# EAGLE schematic Pinscape Pico - Pro (SMD) Expansion Board (EAGLE 7.7.0), part 1 of 2

## Sheet 1 of 12: Main
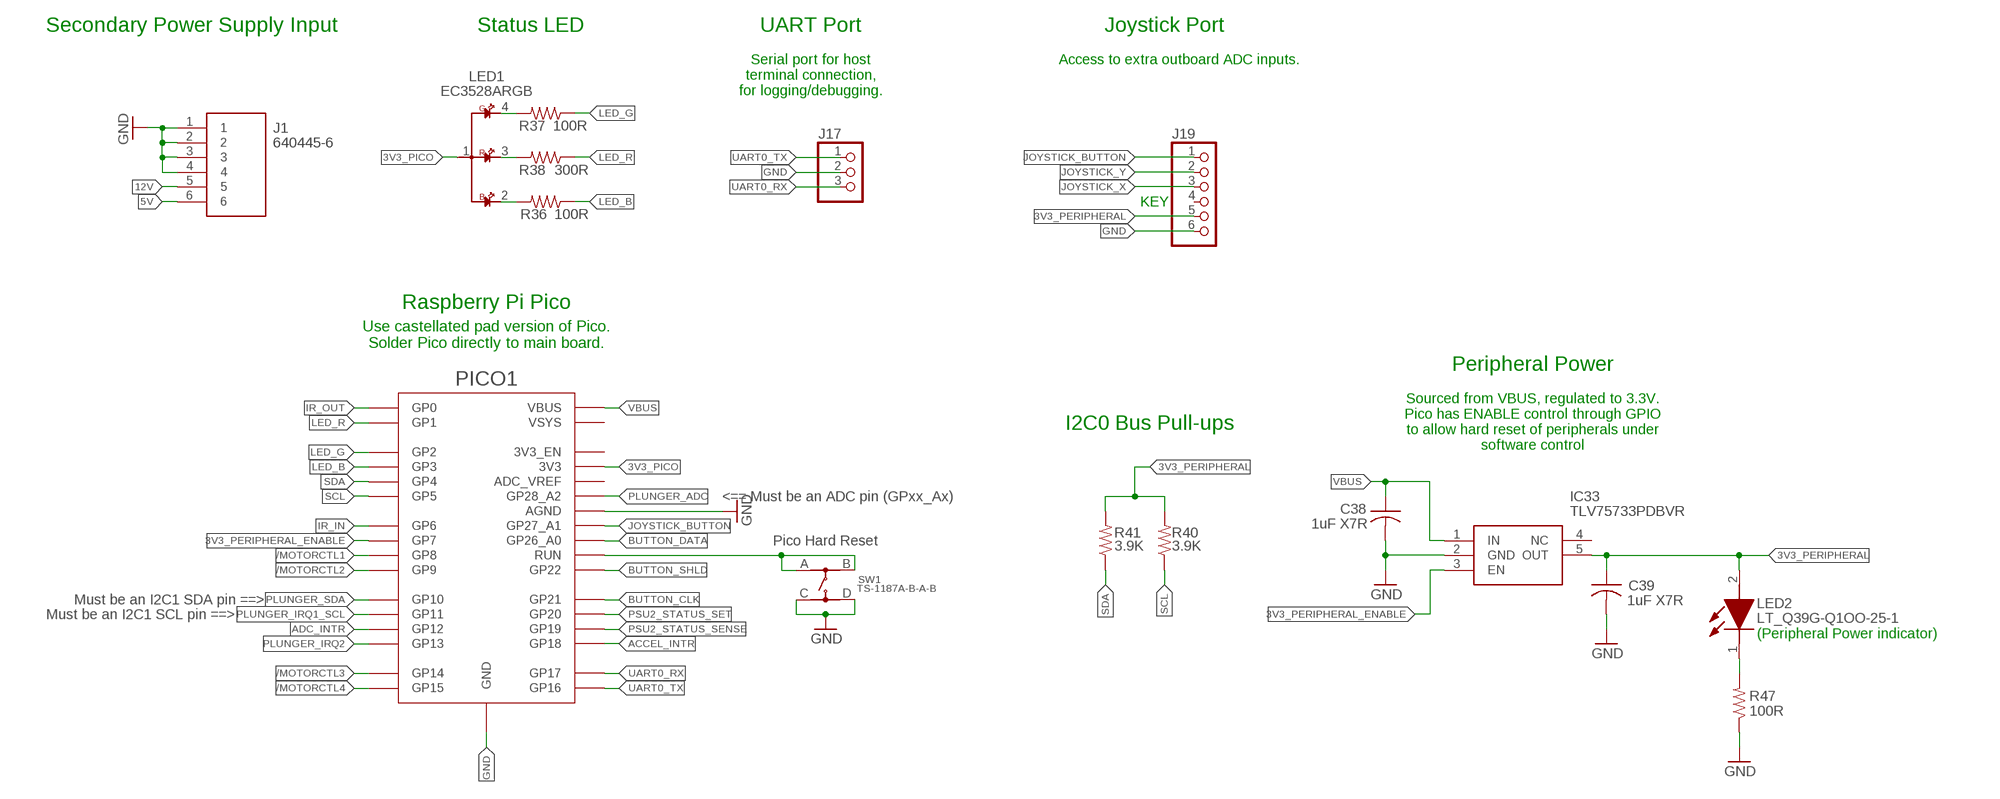
[diagram p0: schematic, sheet 1]

### Parts
C38  1uF X7R  C-USC1206  [C1206]
C39  1uF X7R  C-USC1206  [C1206]
IC33  TLV75733PDBVR  [SOT95P280X145-5N]
J1  640445-6  [SHDR6W183P0X396_1X6_2377X762X1]
J17  PINHD-1X3  [1X03]
J19  PINHD-1X6  [1X06]
LED1  EC3528ARGB  [EC3528ARGB]
LED2  LT_Q39G-Q1OO-25-1  [LEDC1608X40N]
PICO1  PICO  RPI_PICO_NO_DEBUG  [RPI_PICO_TH_NO_DEBUG]
R36  100R  R-US_R0402  [R0402]
R37  100R  R-US_R0402  [R0402]
R38  300R  R-US_R0402  [R0402]
R40  3.9K  R-US_R0603  [R0603]
R41  3.9K  R-US_R0603  [R0603]
R47  100R  R-US_R0402  [R0402]
SW1  TS-1187A-B-A-B  [TS-1187A-B-A-B]

### Nets
3V3_PERIPHERAL: C39.1 IC33.5(OUT) J19.5 LED2.2(A) R40.2 R41.2 ; also sheet 2,5,6,7,8,9,10,11
3V3_PERIPHERAL_ENABLE: IC33.3(EN) PICO1.GP7
3V3_PICO: LED1.1 PICO1.3V3 ; also sheet 3
5V: J1.6 ; also sheet 6,8,9,10
12V: J1.5 ; also sheet 4,5
/MOTORCTL1: PICO1.GP8 ; also sheet 4
/MOTORCTL2: PICO1.GP9 ; also sheet 4
/MOTORCTL3: PICO1.GP14 ; also sheet 4
/MOTORCTL4: PICO1.GP15 ; also sheet 4
ACCEL_INTR: PICO1.GP18 ; also sheet 2
ADC_INTR: PICO1.GP12 ; also sheet 8
BUTTON_CLK: PICO1.GP21 ; also sheet 3
BUTTON_DATA: PICO1.GP26_A0 ; also sheet 3
BUTTON_SHLD: PICO1.GP22 ; also sheet 3
GND: C38.2 C39.2 IC33.2(GND) J1.1 J1.2 J1.3 J1.4 J17.2 J19.6 PICO1.AGND PICO1.GND@1(GND) PICO1.GND@2(GND) PICO1.GND@3(GND) PICO1.GND@4(GND) PICO1.GND@6(GND) PICO1.GND@7(GND) PICO1.GND@8(GND) R47.1 SW1.C SW1.D ; also sheet 2,3,4,5,6,7,8,9,10,11
IR_IN: PICO1.GP6 ; also sheet 10
IR_OUT: PICO1.GP0 ; also sheet 10
JOYSTICK_BUTTON: J19.1 PICO1.GP27_A1 ; also sheet 3
JOYSTICK_X: J19.3 ; also sheet 8
JOYSTICK_Y: J19.2 ; also sheet 8
LED_B: PICO1.GP3 R36.1
LED_G: PICO1.GP2 R37.1
LED_R: PICO1.GP1 R38.1
N$8: LED1.3 R38.2
N$10: LED1.2 R36.2
N$13: LED1.4 R37.2
N$70: PICO1.RUN SW1.A SW1.B
N$74: LED2.1(K) R47.2
PLUNGER_ADC: PICO1.GP28_A2 ; also sheet 8
PLUNGER_IRQ1_SCL: PICO1.GP11 ; also sheet 8
PLUNGER_IRQ2: PICO1.GP13 ; also sheet 8
PLUNGER_SDA: PICO1.GP10 ; also sheet 8
PSU2_STATUS_SENSE: PICO1.GP19 ; also sheet 9
PSU2_STATUS_SET: PICO1.GP20 ; also sheet 9
SCL: PICO1.GP5 R40.1 ; also sheet 2,5,6,7,8,11
SDA: PICO1.GP4 R41.1 ; also sheet 2,5,6,7,8,11
UART0_RX: J17.3 PICO1.GP17
UART0_TX: J17.1 PICO1.GP16
VBUS: C38.1 IC33.1(IN) PICO1.VBUS
Unconnected: IC33.4(NC) J19.4 PICO1.3V3_EN PICO1.ADC_VREF PICO1.VSYS

### Notes on the sheet
- Secondary Power Supply Input | Status LED | UART Port | Joystick Port
- Serial port for host
  terminal connection,
  for logging/debugging.
- Access to extra outboard ADC inputs.
- KEY
- Raspberry Pi Pico
- Use castellated pad version of Pico.
  Solder Pico directly to main board.
- Peripheral Power
- Sourced from VBUS, regulated to 3.3V.
  Pico has ENABLE control through GPIO
  to allow hard reset of peripherals under
  software control
- I2C0 Bus Pull-ups
- <== Must be an ADC pin (GPxx_Ax)
- Pico Hard Reset
- Must be an I2C1 SDA pin ==>
- Must be an I2C1 SCL pin ==>
- (Peripheral Power indicator)

## Sheet 2 of 12: Accelerometer
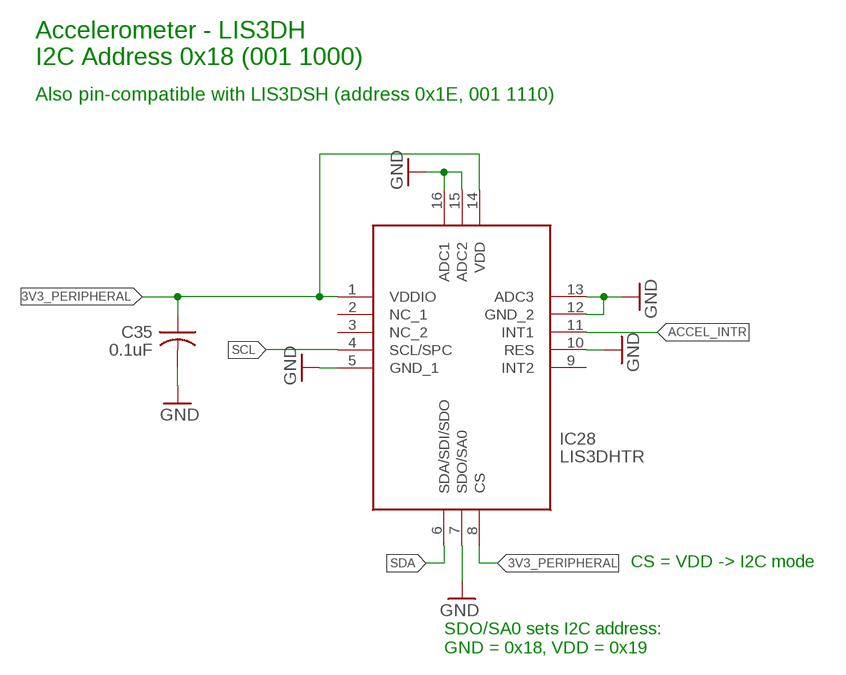
[diagram p1: schematic, sheet 2]

### Parts
C35  0.1uF  C-USC0402  [C0402]
IC28  LIS3DHTR  [LIS3DHTR]

### Nets
3V3_PERIPHERAL: C35.1 IC28.1(VDDIO) IC28.8(CS) IC28.14(VDD) ; also sheet 1,5,6,7,8,9,10,11
ACCEL_INTR: IC28.11(INT1) ; also sheet 1
GND: C35.2 IC28.5(GND_1) IC28.7(SDO/SA0) IC28.10(RES) IC28.12(GND_2) IC28.13(ADC3) IC28.15(ADC2) IC28.16(ADC1) ; also sheet 1,3,4,5,6,7,8,9,10,11
SCL: IC28.4(SCL/SPC) ; also sheet 1,5,6,7,8,11
SDA: IC28.6(SDA/SDI/SDO) ; also sheet 1,5,6,7,8,11
Unconnected: IC28.2(NC_1) IC28.3(NC_2) IC28.9(INT2)

### Notes on the sheet
- Accelerometer - LIS3DH
  I2C Address 0x18 (001 1000)
- Also pin-compatible with LIS3DSH (address 0x1E, 001 1110)
- CS = VDD -> I2C mode
- SDO/SA0 sets I2C address:
  GND = 0x18, VDD = 0x19

## Sheet 3 of 12: Button Inputs
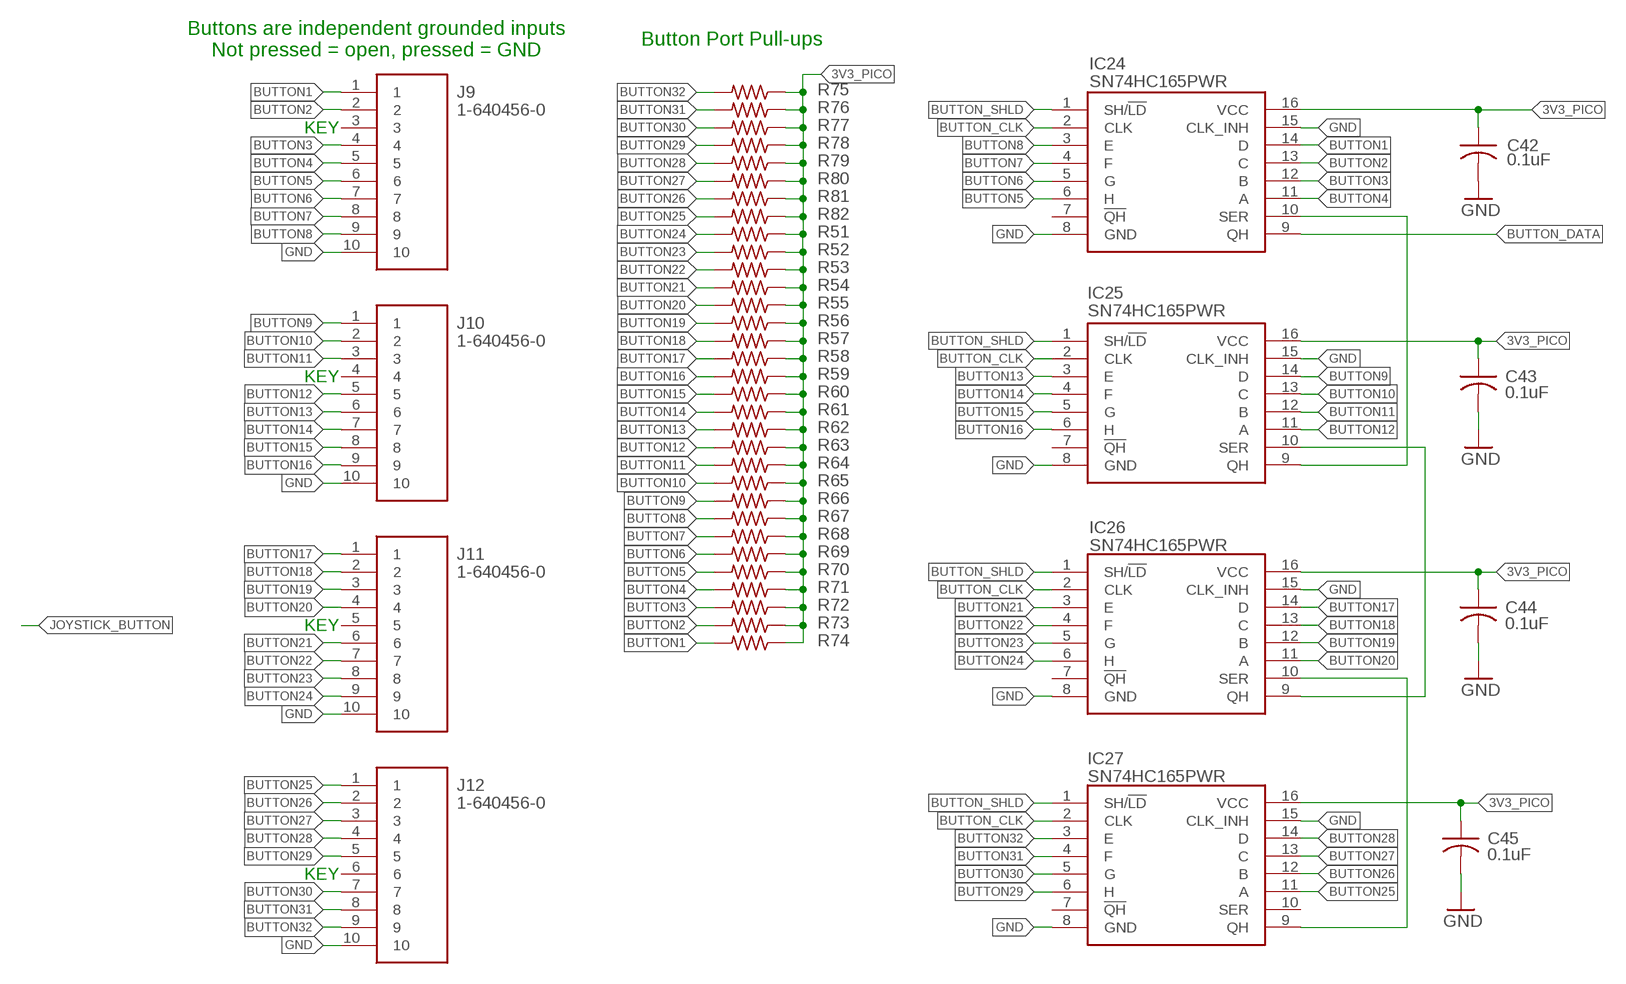
[diagram p2: schematic, sheet 3]

### Parts
C42  0.1uF  C-USC0402  [C0402]
C43  0.1uF  C-USC0402  [C0402]
C44  0.1uF  C-USC0402  [C0402]
C45  0.1uF  C-USC0402  [C0402]
IC24  SN74HC165PWR  [SOP65P640X120-16N]
IC25  SN74HC165PWR  [SOP65P640X120-16N]
IC26  SN74HC165PWR  [SOP65P640X120-16N]
IC27  SN74HC165PWR  [SOP65P640X120-16N]
J9  1-640456-0  [SHDR10W66P0X254_1X10_2540X572X]
J10  1-640456-0  [SHDR10W66P0X254_1X10_2540X572X]
J11  1-640456-0  [SHDR10W66P0X254_1X10_2540X572X]
J12  1-640456-0  [SHDR10W66P0X254_1X10_2540X572X]
R51  10k  R-US_R0402  [R0402]
R52  10k  R-US_R0402  [R0402]
R53  10k  R-US_R0402  [R0402]
R54  10k  R-US_R0402  [R0402]
R55  10k  R-US_R0402  [R0402]
R56  10k  R-US_R0402  [R0402]
R57  10k  R-US_R0402  [R0402]
R58  10k  R-US_R0402  [R0402]
R59  10k  R-US_R0402  [R0402]
R60  10k  R-US_R0402  [R0402]
R61  10k  R-US_R0402  [R0402]
R62  10k  R-US_R0402  [R0402]
R63  10k  R-US_R0402  [R0402]
R64  10k  R-US_R0402  [R0402]
R65  10k  R-US_R0402  [R0402]
R66  10k  R-US_R0402  [R0402]
R67  10k  R-US_R0402  [R0402]
R68  10k  R-US_R0402  [R0402]
R69  10k  R-US_R0402  [R0402]
R70  10k  R-US_R0402  [R0402]
R71  10k  R-US_R0402  [R0402]
R72  10k  R-US_R0402  [R0402]
R73  10k  R-US_R0402  [R0402]
R74  10k  R-US_R0402  [R0402]
R75  10k  R-US_R0402  [R0402]
R76  10k  R-US_R0402  [R0402]
R77  10k  R-US_R0402  [R0402]
R78  10k  R-US_R0402  [R0402]
R79  10k  R-US_R0402  [R0402]
R80  10k  R-US_R0402  [R0402]
R81  10k  R-US_R0402  [R0402]
R82  10k  R-US_R0402  [R0402]

### Nets
3V3_PICO: C42.1 C43.1 C44.1 C45.1 IC24.16(VCC) IC25.16(VCC) IC26.16(VCC) IC27.16(VCC) R51.1 R52.1 R53.1 R54.1 R55.1 R56.1 R57.1 R58.1 R59.1 R60.1 R61.1 R62.1 R63.1 R64.1 R65.1 R66.1 R67.1 R68.1 R69.1 R70.1 R71.1 R72.1 R73.1 R74.1 R75.1 R76.1 R77.1 R78.1 R79.1 R80.1 R81.1 R82.1 ; also sheet 1
BUTTON1: IC24.14(D) J9.1 R74.2
BUTTON2: IC24.13(C) J9.2 R73.2
BUTTON3: IC24.12(B) J9.4 R72.2
BUTTON4: IC24.11(A) J9.5 R71.2
BUTTON5: IC24.6(H) J9.6 R70.2
BUTTON6: IC24.5(G) J9.7 R69.2
BUTTON7: IC24.4(F) J9.8 R68.2
BUTTON8: IC24.3(E) J9.9 R67.2
BUTTON9: IC25.14(D) J10.1 R66.2
BUTTON10: IC25.13(C) J10.2 R65.2
BUTTON11: IC25.12(B) J10.3 R64.2
BUTTON12: IC25.11(A) J10.5 R63.2
BUTTON13: IC25.3(E) J10.6 R62.2
BUTTON14: IC25.4(F) J10.7 R61.2
BUTTON15: IC25.5(G) J10.8 R60.2
BUTTON16: IC25.6(H) J10.9 R59.2
BUTTON17: IC26.14(D) J11.1 R58.2
BUTTON18: IC26.13(C) J11.2 R57.2
BUTTON19: IC26.12(B) J11.3 R56.2
BUTTON20: IC26.11(A) J11.4 R55.2
BUTTON21: IC26.3(E) J11.6 R54.2
BUTTON22: IC26.4(F) J11.7 R53.2
BUTTON23: IC26.5(G) J11.8 R52.2
BUTTON24: IC26.6(H) J11.9 R51.2
BUTTON25: IC27.11(A) J12.1 R82.2
BUTTON26: IC27.12(B) J12.2 R81.2
BUTTON27: IC27.13(C) J12.3 R80.2
BUTTON28: IC27.14(D) J12.4 R79.2
BUTTON29: IC27.6(H) J12.5 R78.2
BUTTON30: IC27.5(G) J12.7 R77.2
BUTTON31: IC27.4(F) J12.8 R76.2
BUTTON32: IC27.3(E) J12.9 R75.2
BUTTON_CLK: IC24.2(CLK) IC25.2(CLK) IC26.2(CLK) IC27.2(CLK) ; also sheet 1
BUTTON_DATA: IC24.9(QH) ; also sheet 1
BUTTON_SHLD: IC24.1(SH/!LD) IC25.1(SH/!LD) IC26.1(SH/!LD) IC27.1(SH/!LD) ; also sheet 1
GND: C42.2 C43.2 C44.2 C45.2 IC24.8(GND) IC24.15(CLK_INH) IC25.8(GND) IC25.15(CLK_INH) IC26.8(GND) IC26.15(CLK_INH) IC27.8(GND) IC27.15(CLK_INH) J9.10 J10.10 J11.10 J12.10 ; also sheet 1,2,4,5,6,7,8,9,10,11
N$78: IC25.10(SER) IC26.9(QH)
N$79: IC24.10(SER) IC25.9(QH)
N$80: IC26.10(SER) IC27.9(QH)
Unconnected: IC24.7(!QH) IC25.7(!QH) IC26.7(!QH) IC27.7(!QH) IC27.10(SER) J9.3 J10.4 J11.5 J12.6

### Notes on the sheet
- Buttons are independent grounded inputs
  Not pressed = open, pressed = GND
- Button Port Pull-ups
- KEY
- KEY
- KEY
- KEY

## Sheet 4 of 12: Motor Outputs
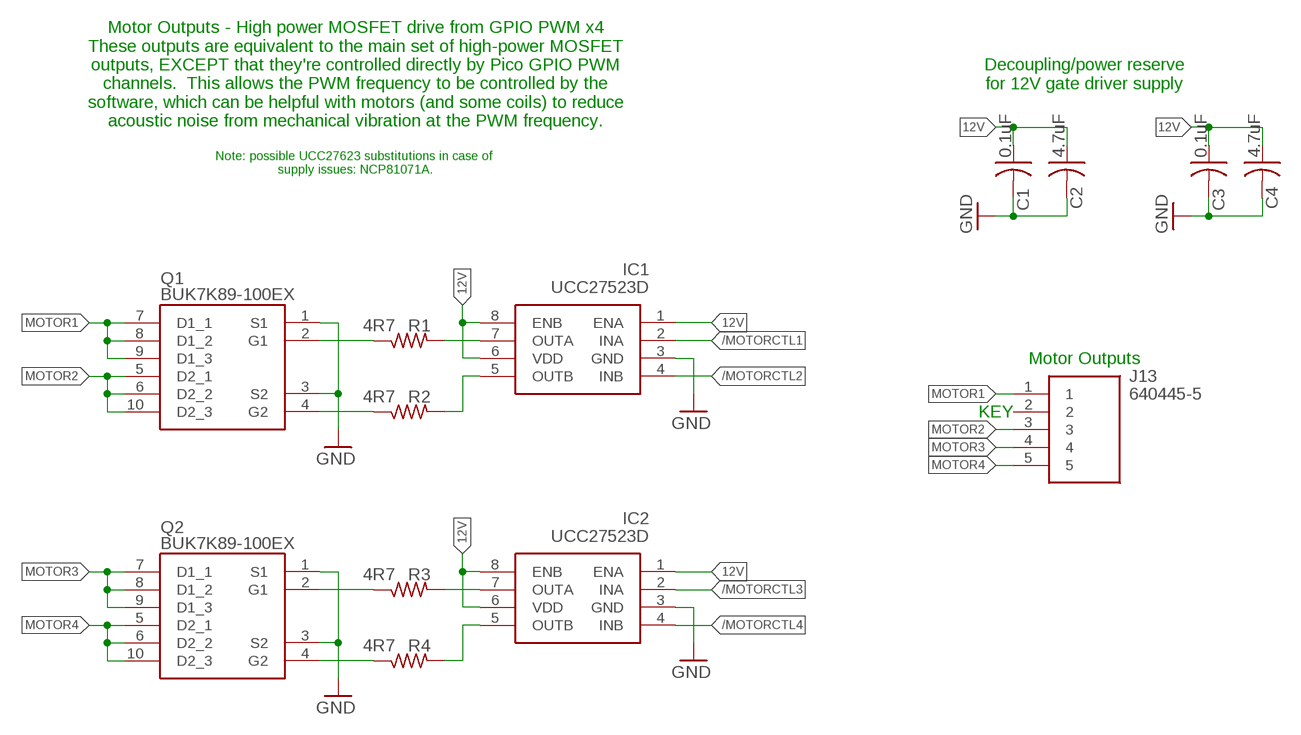
[diagram p3: schematic, sheet 4]

### Parts
C1  0.1uF  C-USC0402  [C0402]
C2  4.7uF  C-USC1206  [C1206]
C3  0.1uF  C-USC0402  [C0402]
C4  4.7uF  C-USC1206  [C1206]
IC1  UCC27523D  UCC27523DR  [SOIC127P600X175-8N]
IC2  UCC27523D  UCC27523DR  [SOIC127P600X175-8N]
J13  640445-5  [HDRV5W117P0X396_1X5_1981X762X1]
Q1  BUK7K89-100EX  [BUK7K89100EX]
Q2  BUK7K89-100EX  [BUK7K89100EX]
R1  4R7  R-US_R0603  [R0603]
R2  4R7  R-US_R0603  [R0603]
R3  4R7  R-US_R0603  [R0603]
R4  4R7  R-US_R0603  [R0603]

### Nets
12V: C1.1 C2.1 C3.1 C4.1 IC1.1(ENA) IC1.6(VDD) IC1.8(ENB) IC2.1(ENA) IC2.6(VDD) IC2.8(ENB) ; also sheet 1,5
/MOTORCTL1: IC1.2(INA) ; also sheet 1
/MOTORCTL2: IC1.4(INB) ; also sheet 1
/MOTORCTL3: IC2.2(INA) ; also sheet 1
/MOTORCTL4: IC2.4(INB) ; also sheet 1
GND: C1.2 C2.2 C3.2 C4.2 IC1.3(GND) IC2.3(GND) Q1.1(S1) Q1.3(S2) Q2.1(S1) Q2.3(S2) ; also sheet 1,2,3,5,6,7,8,9,10,11
MOTOR1: J13.1 Q1.7(D1_1) Q1.8(D1_2) Q1.9(D1_3)
MOTOR2: J13.3 Q1.5(D2_1) Q1.6(D2_2) Q1.10(D2_3)
MOTOR3: J13.4 Q2.7(D1_1) Q2.8(D1_2) Q2.9(D1_3)
MOTOR4: J13.5 Q2.5(D2_1) Q2.6(D2_2) Q2.10(D2_3)
N$14: IC1.5(OUTB) R2.2
N$31: IC2.5(OUTB) R4.2
N$43: IC2.7(OUTA) R3.2
N$61: IC1.7(OUTA) R1.2
N$62: Q1.2(G1) R1.1
N$64: Q1.4(G2) R2.1
N$66: Q2.2(G1) R3.1
N$69: Q2.4(G2) R4.1
Unconnected: J13.2

### Notes on the sheet
- Motor Outputs - High power MOSFET drive from GPIO PWM x4
  These outputs are equivalent to the main set of high-power MOSFET
  outputs, EXCEPT that they're controlled directly by Pico GPIO PWM
  channels.  This allows the PWM frequency to be controlled by the
  software, which can be helpful with motors (and some coils) to reduce
  acoustic noise from mechanical vibration at the PWM frequency.
- Decoupling/power reserve
  for 12V gate driver supply
- Note: possible UCC27623 substitutions in case of 
  supply issues: NCP81071A.
- Motor Outputs
- KEY

## Sheet 5 of 12: MOSFET Output Ports
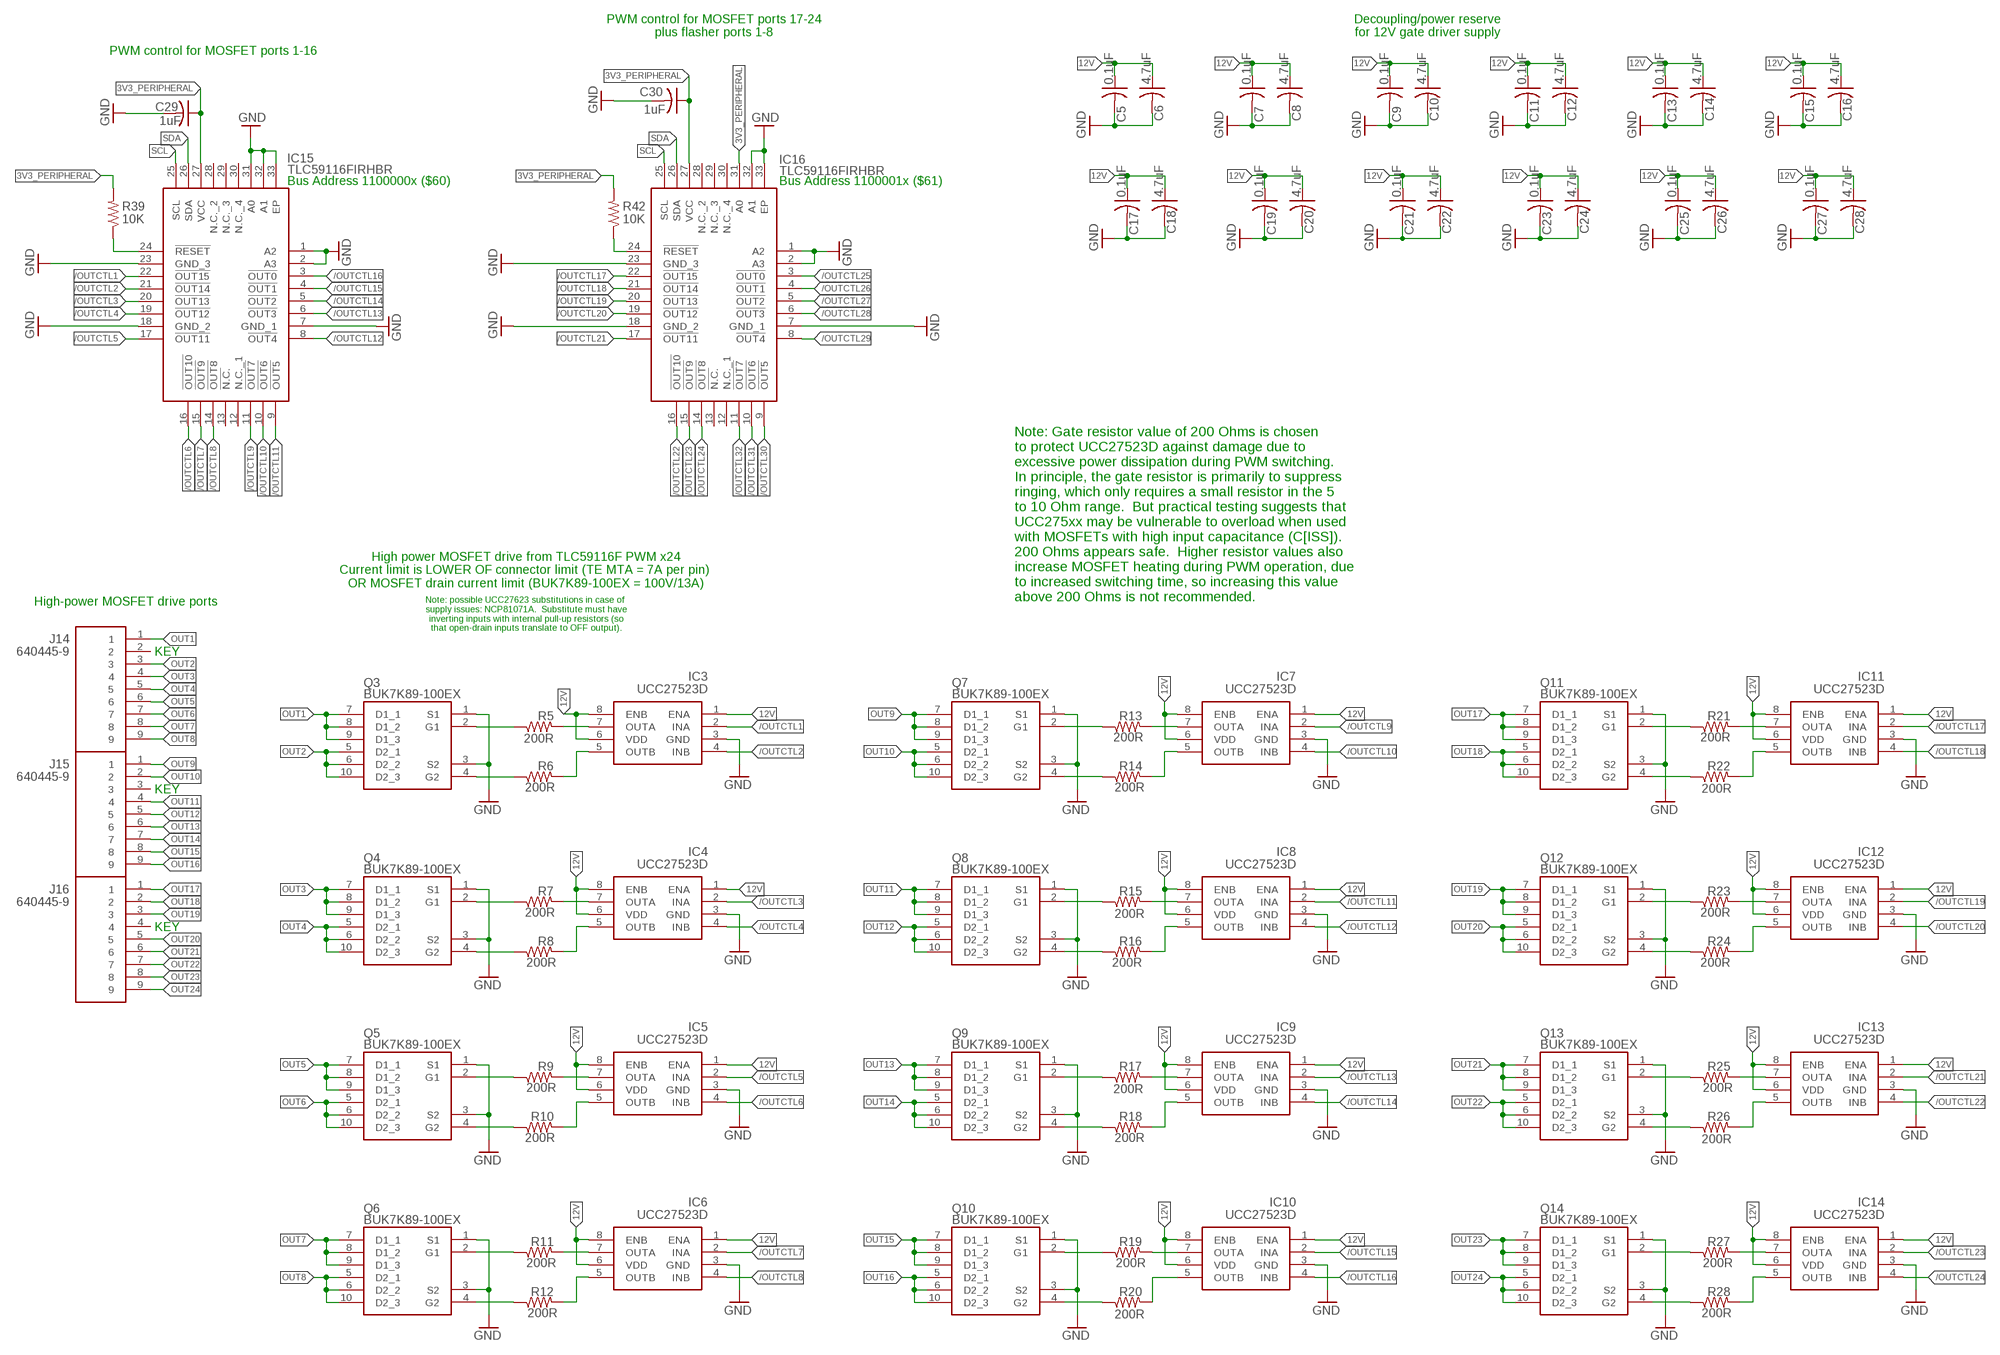
[diagram p4: schematic, sheet 5]

### Parts
C5  0.1uF  C-USC0402  [C0402]
C6  4.7uF  C-USC1206  [C1206]
C7  0.1uF  C-USC0402  [C0402]
C8  4.7uF  C-USC1206  [C1206]
C9  0.1uF  C-USC0402  [C0402]
C10  4.7uF  C-USC1206  [C1206]
C11  0.1uF  C-USC0402  [C0402]
C12  4.7uF  C-USC1206  [C1206]
C13  0.1uF  C-USC0402  [C0402]
C14  4.7uF  C-USC1206  [C1206]
C15  0.1uF  C-USC0402  [C0402]
C16  4.7uF  C-USC1206  [C1206]
C17  0.1uF  C-USC0402  [C0402]
C18  4.7uF  C-USC1206  [C1206]
C19  0.1uF  C-USC0402  [C0402]
C20  4.7uF  C-USC1206  [C1206]
C21  0.1uF  C-USC0402  [C0402]
C22  4.7uF  C-USC1206  [C1206]
C23  0.1uF  C-USC0402  [C0402]
C24  4.7uF  C-USC1206  [C1206]
C25  0.1uF  C-USC0402  [C0402]
C26  4.7uF  C-USC1206  [C1206]
C27  0.1uF  C-USC0402  [C0402]
C28  4.7uF  C-USC1206  [C1206]
C29  1uF  C-USC0402  [C0402]
C30  1uF  C-USC0402  [C0402]
IC3  UCC27523D  UCC27523DR  [SOIC127P600X175-8N]
IC4  UCC27523D  UCC27523DR  [SOIC127P600X175-8N]
IC5  UCC27523D  UCC27523DR  [SOIC127P600X175-8N]
IC6  UCC27523D  UCC27523DR  [SOIC127P600X175-8N]
IC7  UCC27523D  UCC27523DR  [SOIC127P600X175-8N]
IC8  UCC27523D  UCC27523DR  [SOIC127P600X175-8N]
IC9  UCC27523D  UCC27523DR  [SOIC127P600X175-8N]
IC10  UCC27523D  UCC27523DR  [SOIC127P600X175-8N]
IC11  UCC27523D  UCC27523DR  [SOIC127P600X175-8N]
IC12  UCC27523D  UCC27523DR  [SOIC127P600X175-8N]
IC13  UCC27523D  UCC27523DR  [SOIC127P600X175-8N]
IC14  UCC27523D  UCC27523DR  [SOIC127P600X175-8N]
IC15  TLC59116FIRHBR  [QFN50P500X500X100-33N]
IC16  TLC59116FIRHBR  [QFN50P500X500X100-33N]
J14  640445-9  [SHDR9W117P0X396_1X9_3566X762X1]
J15  640445-9  [SHDR9W117P0X396_1X9_3566X762X1]
J16  640445-9  [SHDR9W117P0X396_1X9_3566X762X1]
Q3  BUK7K89-100EX  [BUK7K89100EX]
Q4  BUK7K89-100EX  [BUK7K89100EX]
Q5  BUK7K89-100EX  [BUK7K89100EX]
Q6  BUK7K89-100EX  [BUK7K89100EX]
Q7  BUK7K89-100EX  [BUK7K89100EX]
Q8  BUK7K89-100EX  [BUK7K89100EX]
Q9  BUK7K89-100EX  [BUK7K89100EX]
Q10  BUK7K89-100EX  [BUK7K89100EX]
Q11  BUK7K89-100EX  [BUK7K89100EX]
Q12  BUK7K89-100EX  [BUK7K89100EX]
Q13  BUK7K89-100EX  [BUK7K89100EX]
Q14  BUK7K89-100EX  [BUK7K89100EX]
R5  200R  R-US_R0603  [R0603]
R6  200R  R-US_R0603  [R0603]
R7  200R  R-US_R0603  [R0603]
R8  200R  R-US_R0603  [R0603]
R9  200R  R-US_R0603  [R0603]
R10  200R  R-US_R0603  [R0603]
R11  200R  R-US_R0603  [R0603]
R12  200R  R-US_R0603  [R0603]
R13  200R  R-US_R0603  [R0603]
R14  200R  R-US_R0603  [R0603]
R15  200R  R-US_R0603  [R0603]
R16  200R  R-US_R0603  [R0603]
R17  200R  R-US_R0603  [R0603]
R18  200R  R-US_R0603  [R0603]
R19  200R  R-US_R0603  [R0603]
R20  200R  R-US_R0603  [R0603]
R21  200R  R-US_R0603  [R0603]
R22  200R  R-US_R0603  [R0603]
R23  200R  R-US_R0603  [R0603]
R24  200R  R-US_R0603  [R0603]
R25  200R  R-US_R0603  [R0603]
R26  200R  R-US_R0603  [R0603]
R27  200R  R-US_R0603  [R0603]
R28  200R  R-US_R0603  [R0603]
R39  10K  R-US_R0402  [R0402]
R42  10K  R-US_R0402  [R0402]

### Nets
3V3_PERIPHERAL: C29.1 C30.1 IC15.27(VCC) IC16.27(VCC) IC16.31(A0) R39.2 R42.2 ; also sheet 1,2,6,7,8,9,10,11
12V: C5.1 C6.1 C7.1 C8.1 C9.1 C10.1 C11.1 C12.1 C13.1 C14.1 C15.1 C16.1 C17.1 C18.1 C19.1 C20.1 C21.1 C22.1 C23.1 C24.1 C25.1 C26.1 C27.1 C28.1 IC3.1(ENA) IC3.6(VDD) IC3.8(ENB) IC4.1(ENA) IC4.6(VDD) IC4.8(ENB) IC5.1(ENA) IC5.6(VDD) IC5.8(ENB) IC6.1(ENA) IC6.6(VDD) IC6.8(ENB) IC7.1(ENA) IC7.6(VDD) IC7.8(ENB) IC8.1(ENA) IC8.6(VDD) IC8.8(ENB) IC9.1(ENA) IC9.6(VDD) IC9.8(ENB) IC10.1(ENA) IC10.6(VDD) IC10.8(ENB) IC11.1(ENA) IC11.6(VDD) IC11.8(ENB) IC12.1(ENA) IC12.6(VDD) IC12.8(ENB) IC13.1(ENA) IC13.6(VDD) IC13.8(ENB) IC14.1(ENA) IC14.6(VDD) IC14.8(ENB) ; also sheet 1,4
/OUTCTL1: IC3.2(INA) IC15.22(!OUT15)
/OUTCTL2: IC3.4(INB) IC15.21(!OUT14)
/OUTCTL3: IC4.2(INA) IC15.20(!OUT13)
/OUTCTL4: IC4.4(INB) IC15.19(!OUT12)
/OUTCTL5: IC5.2(INA) IC15.17(!OUT11)
/OUTCTL6: IC5.4(INB) IC15.16(!OUT10)
/OUTCTL7: IC6.2(INA) IC15.15(!OUT9)
/OUTCTL8: IC6.4(INB) IC15.14(!OUT8)
/OUTCTL9: IC7.2(INA) IC15.11(!OUT7)
/OUTCTL10: IC7.4(INB) IC15.10(!OUT6)
/OUTCTL11: IC8.2(INA) IC15.9(!OUT5)
/OUTCTL12: IC8.4(INB) IC15.8(!OUT4)
/OUTCTL13: IC9.2(INA) IC15.6(!OUT3)
/OUTCTL14: IC9.4(INB) IC15.5(!OUT2)
/OUTCTL15: IC10.2(INA) IC15.4(!OUT1)
/OUTCTL16: IC10.4(INB) IC15.3(!OUT0)
/OUTCTL17: IC11.2(INA) IC16.22(!OUT15)
/OUTCTL18: IC11.4(INB) IC16.21(!OUT14)
/OUTCTL19: IC12.2(INA) IC16.20(!OUT13)
/OUTCTL20: IC12.4(INB) IC16.19(!OUT12)
/OUTCTL21: IC13.2(INA) IC16.17(!OUT11)
/OUTCTL22: IC13.4(INB) IC16.16(!OUT10)
/OUTCTL23: IC14.2(INA) IC16.15(!OUT9)
/OUTCTL24: IC14.4(INB) IC16.14(!OUT8)
/OUTCTL25: IC16.3(!OUT0) ; also sheet 6
/OUTCTL26: IC16.4(!OUT1) ; also sheet 6
/OUTCTL27: IC16.5(!OUT2) ; also sheet 6
/OUTCTL28: IC16.6(!OUT3) ; also sheet 6
/OUTCTL29: IC16.8(!OUT4) ; also sheet 6
/OUTCTL30: IC16.9(!OUT5) ; also sheet 6
/OUTCTL31: IC16.10(!OUT6) ; also sheet 6
/OUTCTL32: IC16.11(!OUT7) ; also sheet 6
GND: C5.2 C6.2 C7.2 C8.2 C9.2 C10.2 C11.2 C12.2 C13.2 C14.2 C15.2 C16.2 C17.2 C18.2 C19.2 C20.2 C21.2 C22.2 C23.2 C24.2 C25.2 C26.2 C27.2 C28.2 C29.2 C30.2 IC3.3(GND) IC4.3(GND) IC5.3(GND) IC6.3(GND) IC7.3(GND) IC8.3(GND) IC9.3(GND) IC10.3(GND) IC11.3(GND) IC12.3(GND) IC13.3(GND) IC14.3(GND) IC15.1(A2) IC15.2(A3) IC15.7(GND_1) IC15.18(GND_2) IC15.23(GND_3) IC15.31(A0) IC15.32(A1) IC15.33(EP) IC16.1(A2) IC16.2(A3) IC16.7(GND_1) IC16.18(GND_2) IC16.23(GND_3) IC16.32(A1) IC16.33(EP) Q3.1(S1) Q3.3(S2) Q4.1(S1) Q4.3(S2) Q5.1(S1) Q5.3(S2) Q6.1(S1) Q6.3(S2) Q7.1(S1) Q7.3(S2) Q8.1(S1) Q8.3(S2) Q9.1(S1) Q9.3(S2) Q10.1(S1) Q10.3(S2) Q11.1(S1) Q11.3(S2) Q12.1(S1) Q12.3(S2) Q13.1(S1) Q13.3(S2) Q14.1(S1) Q14.3(S2) ; also sheet 1,2,3,4,6,7,8,9,10,11
N$1: IC15.24(!RESET) R39.1
N$2: IC3.5(OUTB) R6.2
N$3: IC4.7(OUTA) R7.2
N$4: IC7.7(OUTA) R13.2
N$5: IC5.5(OUTB) R10.2
N$6: IC6.7(OUTA) R11.2
N$7: IC6.5(OUTB) R12.2
N$9: IC9.7(OUTA) R17.2
N$11: IC8.7(OUTA) R15.2
N$12: IC8.5(OUTB) R16.2
N$15: IC9.5(OUTB) R18.2
N$16: IC10.7(OUTA) R19.2
N$17: IC10.5(OUTB) R20.2
N$18: IC12.7(OUTA) R23.2
N$19: IC11.7(OUTA) R21.2
N$20: IC11.5(OUTB) R22.2
N$21: IC14.7(OUTA) R27.2
N$22: IC12.5(OUTB) R24.2
N$23: IC13.5(OUTB) R26.2
N$24: IC13.7(OUTA) R25.2
N$25: IC14.5(OUTB) R28.2
N$26: Q11.2(G1) R21.1
N$27: IC5.7(OUTA) R9.2
N$28: IC7.5(OUTB) R14.2
N$29: Q11.4(G2) R22.1
N$30: IC4.5(OUTB) R8.2
N$33: IC3.7(OUTA) R5.2
N$34: Q12.2(G1) R23.1
N$35: Q12.4(G2) R24.1
N$36: Q13.2(G1) R25.1
N$37: Q13.4(G2) R26.1
N$38: Q14.2(G1) R27.1
N$39: Q14.4(G2) R28.1
N$40: Q7.2(G1) R13.1
N$41: Q7.4(G2) R14.1
N$42: Q8.2(G1) R15.1
N$44: Q10.4(G2) R20.1
N$45: Q10.2(G1) R19.1
N$46: Q9.4(G2) R18.1
N$47: Q9.2(G1) R17.1
N$48: Q8.4(G2) R16.1
N$49: Q6.4(G2) R12.1
N$50: Q6.2(G1) R11.1
N$51: Q5.4(G2) R10.1
N$52: Q5.2(G1) R9.1
N$53: Q4.4(G2) R8.1
N$54: Q4.2(G1) R7.1
N$55: Q3.4(G2) R6.1
N$56: Q3.2(G1) R5.1
N$57: IC16.24(!RESET) R42.1
OUT1: J14.1 Q3.7(D1_1) Q3.8(D1_2) Q3.9(D1_3)
OUT2: J14.3 Q3.5(D2_1) Q3.6(D2_2) Q3.10(D2_3)
OUT3: J14.4 Q4.7(D1_1) Q4.8(D1_2) Q4.9(D1_3)
OUT4: J14.5 Q4.5(D2_1) Q4.6(D2_2) Q4.10(D2_3)
OUT5: J14.6 Q5.7(D1_1) Q5.8(D1_2) Q5.9(D1_3)
OUT6: J14.7 Q5.5(D2_1) Q5.6(D2_2) Q5.10(D2_3)
OUT7: J14.8 Q6.7(D1_1) Q6.8(D1_2) Q6.9(D1_3)
OUT8: J14.9 Q6.5(D2_1) Q6.6(D2_2) Q6.10(D2_3)
OUT9: J15.1 Q7.7(D1_1) Q7.8(D1_2) Q7.9(D1_3)
OUT10: J15.2 Q7.5(D2_1) Q7.6(D2_2) Q7.10(D2_3)
OUT11: J15.4 Q8.7(D1_1) Q8.8(D1_2) Q8.9(D1_3)
OUT12: J15.5 Q8.5(D2_1) Q8.6(D2_2) Q8.10(D2_3)
OUT13: J15.6 Q9.7(D1_1) Q9.8(D1_2) Q9.9(D1_3)
OUT14: J15.7 Q9.5(D2_1) Q9.6(D2_2) Q9.10(D2_3)
OUT15: J15.8 Q10.7(D1_1) Q10.8(D1_2) Q10.9(D1_3)
OUT16: J15.9 Q10.5(D2_1) Q10.6(D2_2) Q10.10(D2_3)
OUT17: J16.1 Q11.7(D1_1) Q11.8(D1_2) Q11.9(D1_3)
OUT18: J16.2 Q11.5(D2_1) Q11.6(D2_2) Q11.10(D2_3)
OUT19: J16.3 Q12.7(D1_1) Q12.8(D1_2) Q12.9(D1_3)
OUT20: J16.5 Q12.5(D2_1) Q12.6(D2_2) Q12.10(D2_3)
OUT21: J16.6 Q13.7(D1_1) Q13.8(D1_2) Q13.9(D1_3)
OUT22: J16.7 Q13.5(D2_1) Q13.6(D2_2) Q13.10(D2_3)
OUT23: J16.8 Q14.7(D1_1) Q14.8(D1_2) Q14.9(D1_3)
OUT24: J16.9 Q14.5(D2_1) Q14.6(D2_2) Q14.10(D2_3)
SCL: IC15.25(SCL) IC16.25(SCL) ; also sheet 1,2,6,7,8,11
SDA: IC15.26(SDA) IC16.26(SDA) ; also sheet 1,2,6,7,8,11
Unconnected: IC15.12(N.C._1) IC15.13(!N.C.) IC15.28(N.C._2) IC15.29(N.C._3) IC15.30(N.C._4) IC16.12(N.C._1) IC16.13(!N.C.) IC16.28(N.C._2) IC16.29(N.C._3) IC16.30(N.C._4) J14.2 J15.3 J16.4

### Notes on the sheet
- PWM control for MOSFET ports 17-24
  plus flasher ports 1-8
- Decoupling/power reserve
  for 12V gate driver supply
- PWM control for MOSFET ports 1-16
- Bus Address 1100000x ($60) | Bus Address 1100001x ($61)
- Note: Gate resistor value of 200 Ohms is chosen
  to protect UCC27523D against damage due to
  excessive power dissipation during PWM switching.
  In principle, the gate resistor is primarily to suppress
  ringing, which only requires a small resistor in the 5
  to 10 Ohm range.  But practical testing suggests that
  UCC275xx may be vulnerable to overload when used
  with MOSFETs with high input capacitance (C[ISS]).
  200 Ohms appears safe.  Higher resistor values also
  increase MOSFET heating during PWM operation, due
  to increased switching time, so increasing this value
  above 200 Ohms is not recommended.
- High power MOSFET drive from TLC59116F PWM x24
  Current limit is LOWER OF connector limit (TE MTA = 7A per pin) 
  OR MOSFET drain current limit (BUK7K89-100EX = 100V/13A)
- High-power MOSFET drive ports
- Note: possible UCC27623 substitutions in case of 
  supply issues: NCP81071A.  Substitute must have
  inverting inputs with internal pull-up resistors (so
  that open-drain inputs translate to OFF output).
- KEY
- KEY
- KEY

## Sheet 6 of 12: Darlington Output Ports
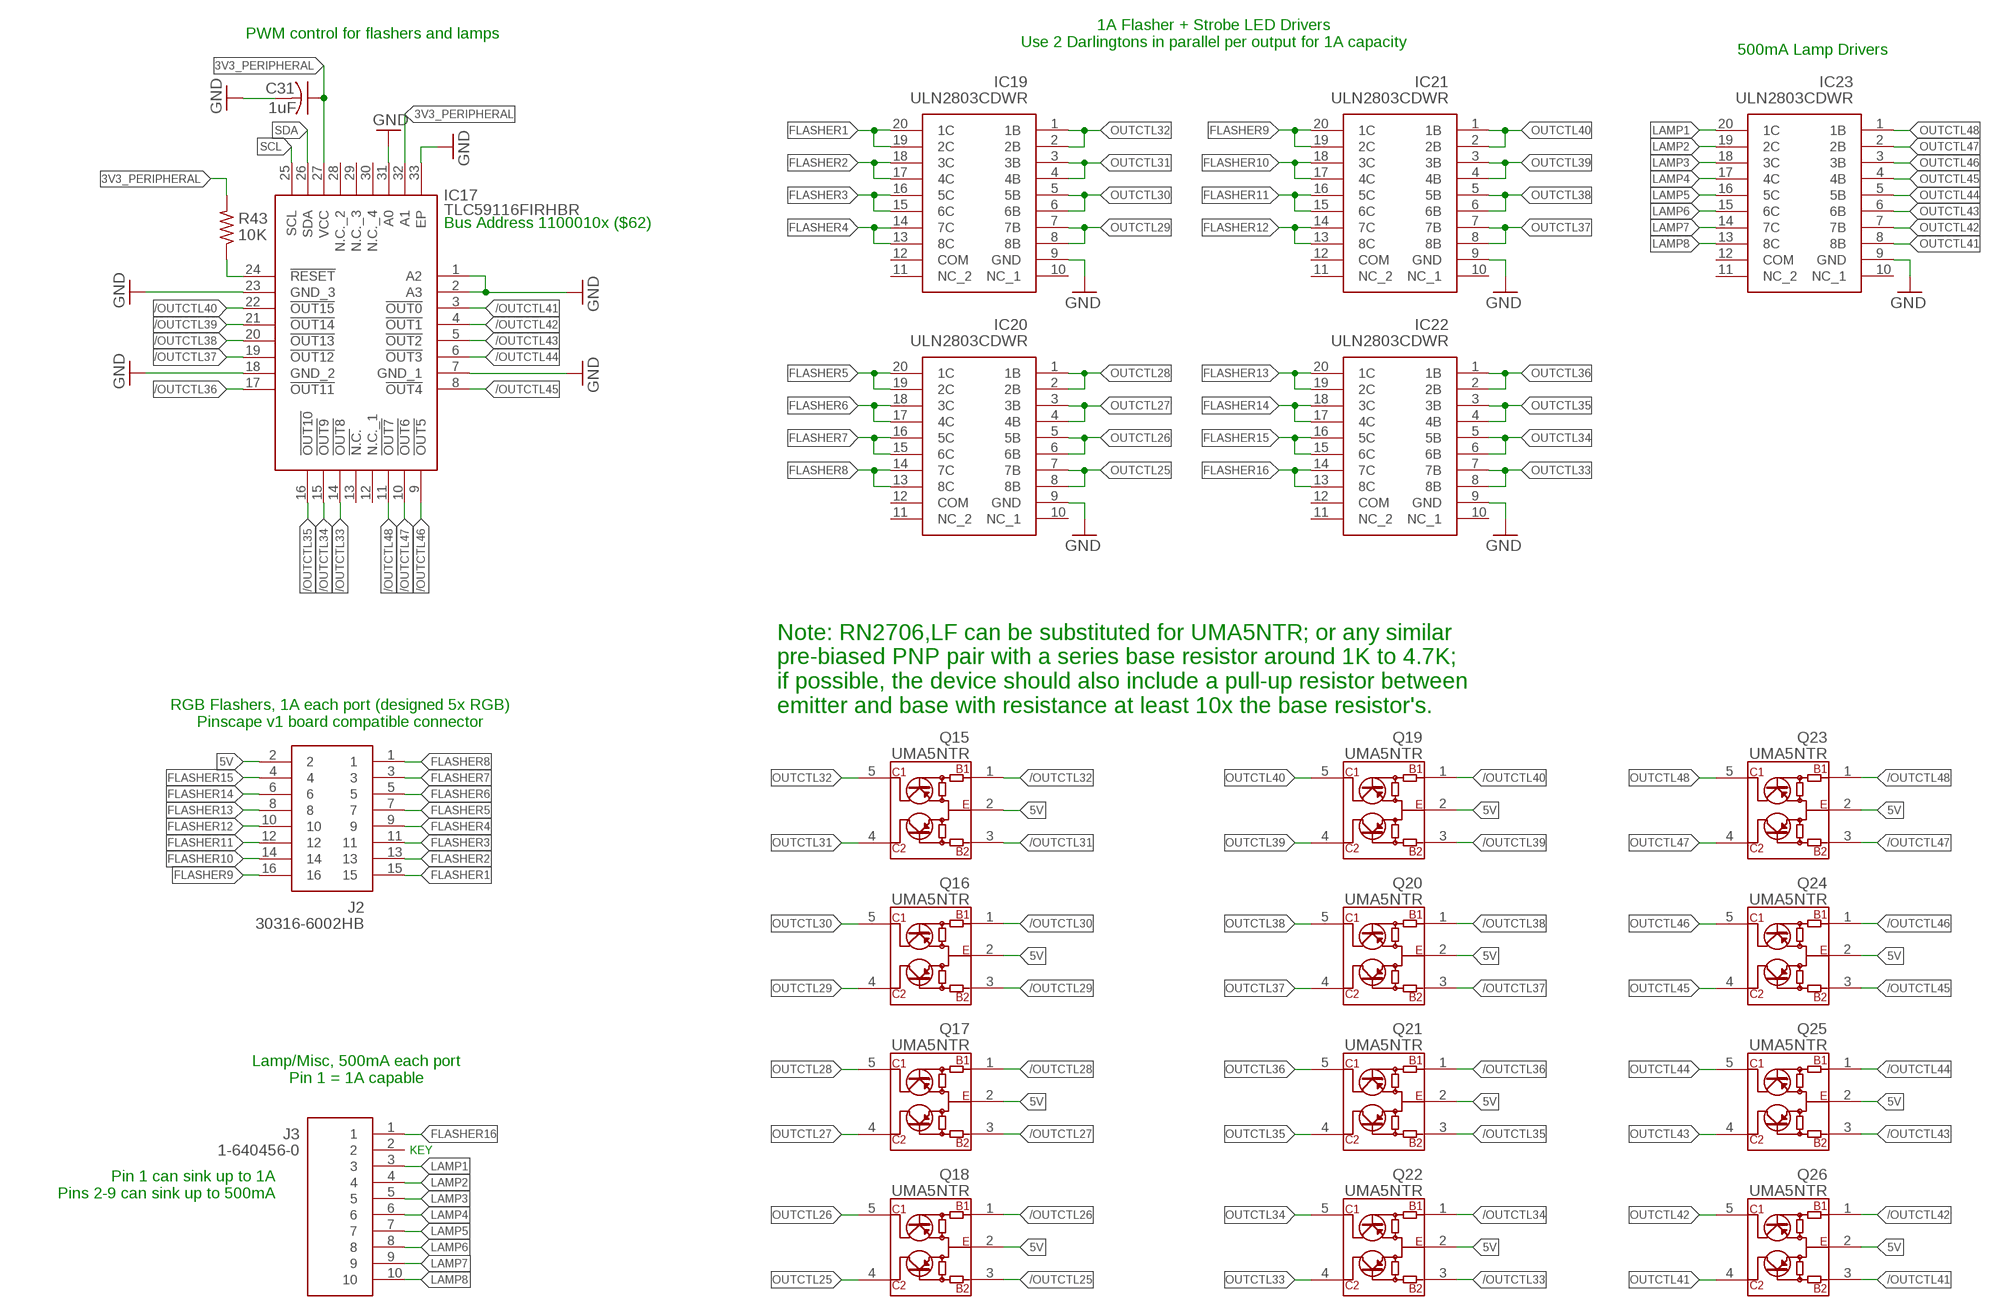
[diagram p5: schematic, sheet 6]

### Parts
C31  1uF  C-USC0402  [C0402]
IC17  TLC59116FIRHBR  [QFN50P500X500X100-33N]
IC19  ULN2803CDWR  [SOIC127P1030X265-20N]
IC20  ULN2803CDWR  [SOIC127P1030X265-20N]
IC21  ULN2803CDWR  [SOIC127P1030X265-20N]
IC22  ULN2803CDWR  [SOIC127P1030X265-20N]
IC23  ULN2803CDWR  [SOIC127P1030X265-20N]
J2  30316-6002HB  [3M-30316-6002HB]
J3  1-640456-0  [SHDR10W66P0X254_1X10_2540X572X]
Q15  UMA5NTR  [SOT65P210X100-5N]
Q16  UMA5NTR  [SOT65P210X100-5N]
Q17  UMA5NTR  [SOT65P210X100-5N]
Q18  UMA5NTR  [SOT65P210X100-5N]
Q19  UMA5NTR  [SOT65P210X100-5N]
Q20  UMA5NTR  [SOT65P210X100-5N]
Q21  UMA5NTR  [SOT65P210X100-5N]
Q22  UMA5NTR  [SOT65P210X100-5N]
Q23  UMA5NTR  [SOT65P210X100-5N]
Q24  UMA5NTR  [SOT65P210X100-5N]
Q25  UMA5NTR  [SOT65P210X100-5N]
Q26  UMA5NTR  [SOT65P210X100-5N]
R43  10K  R-US_R0402  [R0402]

### Nets
3V3_PERIPHERAL: C31.1 IC17.27(VCC) IC17.32(A1) R43.2 ; also sheet 1,2,5,7,8,9,10,11
5V: J2.2 Q15.2(E) Q16.2(E) Q17.2(E) Q18.2(E) Q19.2(E) Q20.2(E) Q21.2(E) Q22.2(E) Q23.2(E) Q24.2(E) Q25.2(E) Q26.2(E) ; also sheet 1,8,9,10
/OUTCTL25: Q18.3(B2) ; also sheet 5
/OUTCTL26: Q18.1(B1) ; also sheet 5
/OUTCTL27: Q17.3(B2) ; also sheet 5
/OUTCTL28: Q17.1(B1) ; also sheet 5
/OUTCTL29: Q16.3(B2) ; also sheet 5
/OUTCTL30: Q16.1(B1) ; also sheet 5
/OUTCTL31: Q15.3(B2) ; also sheet 5
/OUTCTL32: Q15.1(B1) ; also sheet 5
/OUTCTL33: IC17.14(!OUT8) Q22.3(B2)
/OUTCTL34: IC17.15(!OUT9) Q22.1(B1)
/OUTCTL35: IC17.16(!OUT10) Q21.3(B2)
/OUTCTL36: IC17.17(!OUT11) Q21.1(B1)
/OUTCTL37: IC17.19(!OUT12) Q20.3(B2)
/OUTCTL38: IC17.20(!OUT13) Q20.1(B1)
/OUTCTL39: IC17.21(!OUT14) Q19.3(B2)
/OUTCTL40: IC17.22(!OUT15) Q19.1(B1)
/OUTCTL41: IC17.3(!OUT0) Q26.3(B2)
/OUTCTL42: IC17.4(!OUT1) Q26.1(B1)
/OUTCTL43: IC17.5(!OUT2) Q25.3(B2)
/OUTCTL44: IC17.6(!OUT3) Q25.1(B1)
/OUTCTL45: IC17.8(!OUT4) Q24.3(B2)
/OUTCTL46: IC17.9(!OUT5) Q24.1(B1)
/OUTCTL47: IC17.10(!OUT6) Q23.3(B2)
/OUTCTL48: IC17.11(!OUT7) Q23.1(B1)
FLASHER1: IC19.19(2C) IC19.20(1C) J2.15
FLASHER2: IC19.17(4C) IC19.18(3C) J2.13
FLASHER3: IC19.15(6C) IC19.16(5C) J2.11
FLASHER4: IC19.13(8C) IC19.14(7C) J2.9
FLASHER5: IC20.19(2C) IC20.20(1C) J2.7
FLASHER6: IC20.17(4C) IC20.18(3C) J2.5
FLASHER7: IC20.15(6C) IC20.16(5C) J2.3
FLASHER8: IC20.13(8C) IC20.14(7C) J2.1
FLASHER9: IC21.19(2C) IC21.20(1C) J2.16
FLASHER10: IC21.17(4C) IC21.18(3C) J2.14
FLASHER11: IC21.15(6C) IC21.16(5C) J2.12
FLASHER12: IC21.13(8C) IC21.14(7C) J2.10
FLASHER13: IC22.19(2C) IC22.20(1C) J2.8
FLASHER14: IC22.17(4C) IC22.18(3C) J2.6
FLASHER15: IC22.15(6C) IC22.16(5C) J2.4
FLASHER16: IC22.13(8C) IC22.14(7C) J3.1
GND: C31.2 IC17.1(A2) IC17.2(A3) IC17.7(GND_1) IC17.18(GND_2) IC17.23(GND_3) IC17.31(A0) IC17.33(EP) IC19.9(GND) IC20.9(GND) IC21.9(GND) IC22.9(GND) IC23.9(GND) ; also sheet 1,2,3,4,5,7,8,9,10,11
LAMP1: IC23.20(1C) J3.3
LAMP2: IC23.19(2C) J3.4
LAMP3: IC23.18(3C) J3.5
LAMP4: IC23.17(4C) J3.6
LAMP5: IC23.16(5C) J3.7
LAMP6: IC23.15(6C) J3.8
LAMP7: IC23.14(7C) J3.9
LAMP8: IC23.13(8C) J3.10
N$60: IC17.24(!RESET) R43.1
OUTCTL25: IC20.7(7B) IC20.8(8B) Q18.4(C2)
OUTCTL26: IC20.5(5B) IC20.6(6B) Q18.5(C1)
OUTCTL27: IC20.3(3B) IC20.4(4B) Q17.4(C2)
OUTCTL28: IC20.1(1B) IC20.2(2B) Q17.5(C1)
OUTCTL29: IC19.7(7B) IC19.8(8B) Q16.4(C2)
OUTCTL30: IC19.5(5B) IC19.6(6B) Q16.5(C1)
OUTCTL31: IC19.3(3B) IC19.4(4B) Q15.4(C2)
OUTCTL32: IC19.1(1B) IC19.2(2B) Q15.5(C1)
OUTCTL33: IC22.7(7B) IC22.8(8B) Q22.4(C2)
OUTCTL34: IC22.5(5B) IC22.6(6B) Q22.5(C1)
OUTCTL35: IC22.3(3B) IC22.4(4B) Q21.4(C2)
OUTCTL36: IC22.1(1B) IC22.2(2B) Q21.5(C1)
OUTCTL37: IC21.7(7B) IC21.8(8B) Q20.4(C2)
OUTCTL38: IC21.5(5B) IC21.6(6B) Q20.5(C1)
OUTCTL39: IC21.3(3B) IC21.4(4B) Q19.4(C2)
OUTCTL40: IC21.1(1B) IC21.2(2B) Q19.5(C1)
OUTCTL41: IC23.8(8B) Q26.4(C2)
OUTCTL42: IC23.7(7B) Q26.5(C1)
OUTCTL43: IC23.6(6B) Q25.4(C2)
OUTCTL44: IC23.5(5B) Q25.5(C1)
OUTCTL45: IC23.4(4B) Q24.4(C2)
OUTCTL46: IC23.3(3B) Q24.5(C1)
OUTCTL47: IC23.2(2B) Q23.4(C2)
OUTCTL48: IC23.1(1B) Q23.5(C1)
SCL: IC17.25(SCL) ; also sheet 1,2,5,7,8,11
SDA: IC17.26(SDA) ; also sheet 1,2,5,7,8,11
Unconnected: IC17.12(N.C._1) IC17.13(!N.C.) IC17.28(N.C._2) IC17.29(N.C._3) IC17.30(N.C._4) IC19.10(NC_1) IC19.11(NC_2) IC19.12(COM) IC20.10(NC_1) IC20.11(NC_2) IC20.12(COM) IC21.10(NC_1) IC21.11(NC_2) IC21.12(COM) IC22.10(NC_1) IC22.11(NC_2) IC22.12(COM) IC23.10(NC_1) IC23.11(NC_2) IC23.12(COM) J3.2

### Notes on the sheet
- PWM control for flashers and lamps
- 1A Flasher + Strobe LED Drivers
  Use 2 Darlingtons in parallel per output for 1A capacity
- 500mA Lamp Drivers
- Bus Address 1100010x ($62)
- RGB Flashers, 1A each port (designed 5x RGB)
  Pinscape v1 board compatible connector
- Note: RN2706,LF can be substituted for UMA5NTR; or any similar
  pre-biased PNP pair with a series base resistor around 1K to 4.7K;
  if possible, the device should also include a pull-up resistor between
  emitter and base with resistance at least 10x the base resistor's.
- Lamp/Misc, 500mA each port
  Pin 1 = 1A capable
- KEY
- Pin 1 can sink up to 1A
  Pins 2-9 can sink up to 500mA

## Sheet 7 of 12: Small LED outputs
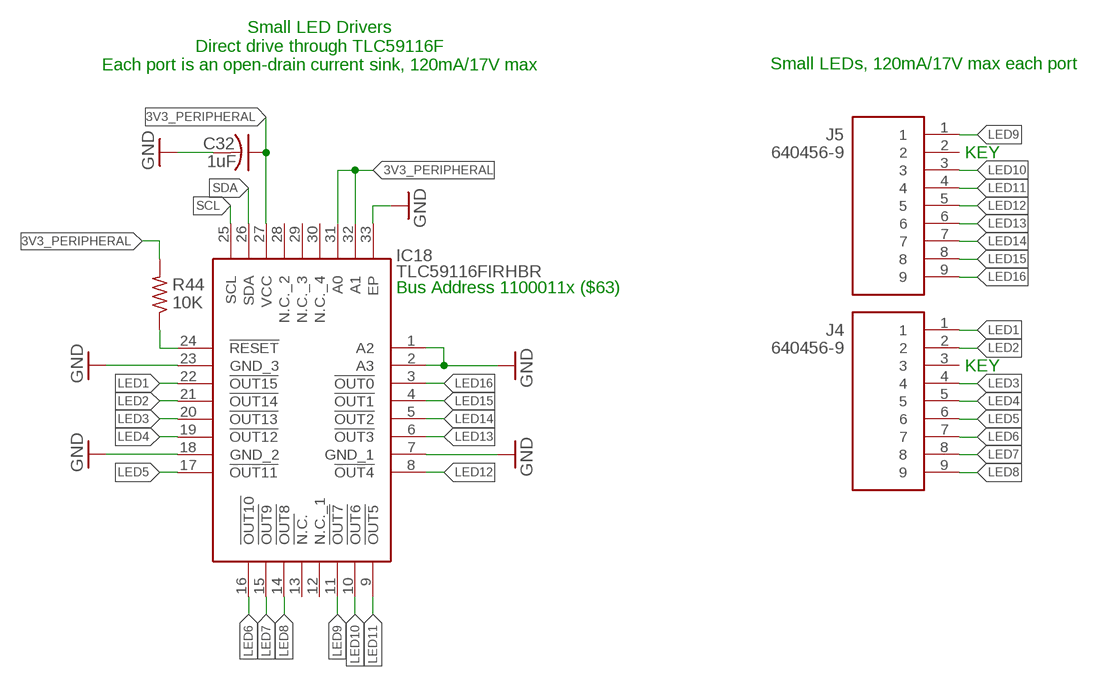
[diagram p6: schematic, sheet 7]

### Parts
C32  1uF  C-USC0402  [C0402]
IC18  TLC59116FIRHBR  [QFN50P500X500X100-33N]
J4  640456-9  [SHDR9W66P0X254_1X9_2286X572X10]
J5  640456-9  [SHDR9W66P0X254_1X9_2286X572X10]
R44  10K  R-US_R0402  [R0402]

### Nets
3V3_PERIPHERAL: C32.1 IC18.27(VCC) IC18.31(A0) IC18.32(A1) R44.2 ; also sheet 1,2,5,6,8,9,10,11
GND: C32.2 IC18.1(A2) IC18.2(A3) IC18.7(GND_1) IC18.18(GND_2) IC18.23(GND_3) IC18.33(EP) ; also sheet 1,2,3,4,5,6,8,9,10,11
LED1: IC18.22(!OUT15) J4.1
LED2: IC18.21(!OUT14) J4.2
LED3: IC18.20(!OUT13) J4.4
LED4: IC18.19(!OUT12) J4.5
LED5: IC18.17(!OUT11) J4.6
LED6: IC18.16(!OUT10) J4.7
LED7: IC18.15(!OUT9) J4.8
LED8: IC18.14(!OUT8) J4.9
LED9: IC18.11(!OUT7) J5.1
LED10: IC18.10(!OUT6) J5.3
LED11: IC18.9(!OUT5) J5.4
LED12: IC18.8(!OUT4) J5.5
LED13: IC18.6(!OUT3) J5.6
LED14: IC18.5(!OUT2) J5.7
LED15: IC18.4(!OUT1) J5.8
LED16: IC18.3(!OUT0) J5.9
N$67: IC18.24(!RESET) R44.1
SCL: IC18.25(SCL) ; also sheet 1,2,5,6,8,11
SDA: IC18.26(SDA) ; also sheet 1,2,5,6,8,11
Unconnected: IC18.12(N.C._1) IC18.13(!N.C.) IC18.28(N.C._2) IC18.29(N.C._3) IC18.30(N.C._4) J4.3 J5.2

### Notes on the sheet
- Small LED Drivers
  Direct drive through TLC59116F
  Each port is an open-drain current sink, 120mA/17V max
- Small LEDs, 120mA/17V max each port
- KEY
- Bus Address 1100011x ($63)
- KEY

## Sheet 8 of 12: Plunger Input
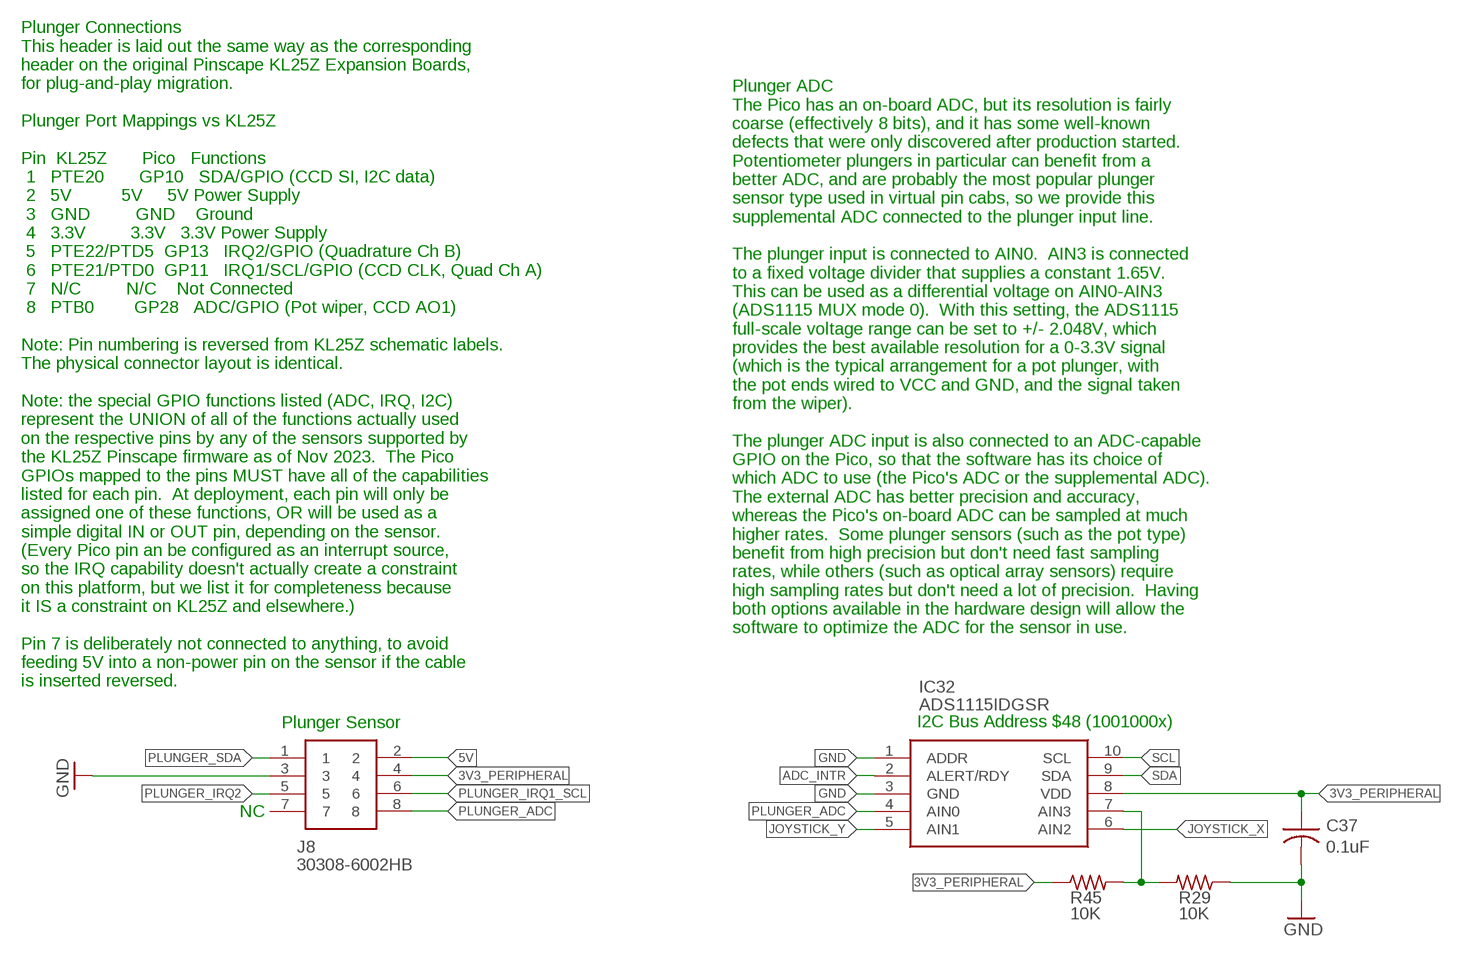
[diagram p7: schematic, sheet 8]

### Parts
C37  0.1uF  C-USC0402  [C0402]
IC32  ADS1115IDGSR  [SOP50P490X110-10N]
J8  30308-6002HB  [SHDR8W69P254_2X4_1780X878X955P]
R29  10K  R-US_R0603  [R0603]
R45  10K  R-US_R0603  [R0603]

### Nets
3V3_PERIPHERAL: C37.1 IC32.8(VDD) J8.4 R45.1 ; also sheet 1,2,5,6,7,9,10,11
5V: J8.2 ; also sheet 1,6,9,10
ADC_INTR: IC32.2(ALERT/RDY) ; also sheet 1
GND: C37.2 IC32.1(ADDR) IC32.3(GND) J8.3 R29.1 ; also sheet 1,2,3,4,5,6,7,9,10,11
JOYSTICK_X: IC32.6(AIN2) ; also sheet 1
JOYSTICK_Y: IC32.5(AIN1) ; also sheet 1
N$71: IC32.7(AIN3) R29.2 R45.2
PLUNGER_ADC: IC32.4(AIN0) J8.8 ; also sheet 1
PLUNGER_IRQ1_SCL: J8.6 ; also sheet 1
PLUNGER_IRQ2: J8.5 ; also sheet 1
PLUNGER_SDA: J8.1 ; also sheet 1
SCL: IC32.10(SCL) ; also sheet 1,2,5,6,7,11
SDA: IC32.9(SDA) ; also sheet 1,2,5,6,7,11
Unconnected: J8.7

### Notes on the sheet
- Plunger ADC
  The Pico has an on-board ADC, but its resolution is fairly
  coarse (effectively 8 bits), and it has some well-known
  defects that were only discovered after production started.
  Potentiometer plungers in particular can benefit from a
  better ADC, and are probably the most popular plunger
  sensor type used in virtual pin cabs, so we provide this
  supplemental ADC connected to the plunger input line.
  
  The plunger input is connected to AIN0.  AIN3 is connected
  to a fixed voltage divider that supplies a constant 1.65V.
  This can be used as a differential voltage on AIN0-AIN3
  (ADS1115 MUX mode 0).  With this setting, the ADS1115
  full-scale voltage range can be set to +/- 2.048V, which
  provides the best available resolution for a 0-3.3V signal
  (which is the typical arrangement for a pot plunger, with
  the pot ends wired to VCC and GND, and the signal taken
  from the wiper).
  
  The plunger ADC input is also connected to an ADC-capable
  GPIO on the Pico, so that the software has its choice of
  which ADC to use (the Pico's ADC or the supplemental ADC).
  The external ADC has better precision and accuracy,
  whereas the Pico's on-board ADC can be sampled at much
  higher rates.  Some plunger sensors (such as the pot type)
  benefit from high precision but don't need fast sampling
  rates, while others (such as optical array sensors) require
  high sampling rates but don't need a lot of precision.  Having
  both options available in the hardware design will allow the
  software to optimize the ADC for the sensor in use.
- Plunger Connections
  This header is laid out the same way as the corresponding
  header on the original Pinscape KL25Z Expansion Boards,
  for plug-and-play migration.
  
  Plunger Port Mappings vs KL25Z
  
  Pin  KL25Z       Pico   Functions
   1   PTE20       GP10   SDA/GPIO (CCD SI, I2C data)
   2   5V          5V     5V Power Supply
   3   GND         GND    Ground
   4   3.3V         3.3V   3.3V Power Supply
   5   PTE22/PTD5  GP13   IRQ2/GPIO (Quadrature Ch B)
   6   PTE21/PTD0  GP11   IRQ1/SCL/GPIO (CCD CLK, Quad Ch A)
   7   N/C         N/C    Not Connected
   8   PTB0        GP28   ADC/GPIO (Pot wiper, CCD AO1)
  
  Note: Pin numbering is reversed from KL25Z schematic labels.
  The physical connector layout is identical.
  
  Note: the special GPIO functions listed (ADC, IRQ, I2C)
  represent the UNION of all of the functions actually used
  on the respective pins by any of the sensors supported by
  the KL25Z Pinscape firmware as of Nov 2023.  The Pico
  GPIOs mapped to the pins MUST have all of the capabilities
  listed for each pin.  At deployment, each pin will only be
  assigned one of these functions, OR will be used as a
  simple digital IN or OUT pin, depending on the sensor.
  (Every Pico pin an be configured as an interrupt source,
  so the IRQ capability doesn't actually create a constraint
  on this platform, but we list it for completeness because
  it IS a constraint on KL25Z and elsewhere.)
  
  Pin 7 is deliberately not connected to anything, to avoid
  feeding 5V into a non-power pin on the sensor if the cable
  is inserted reversed.
- Plunger Sensor
- I2C Bus Address $48 (1001000x)
- NC

## Sheet 9 of 12: Power Sensing
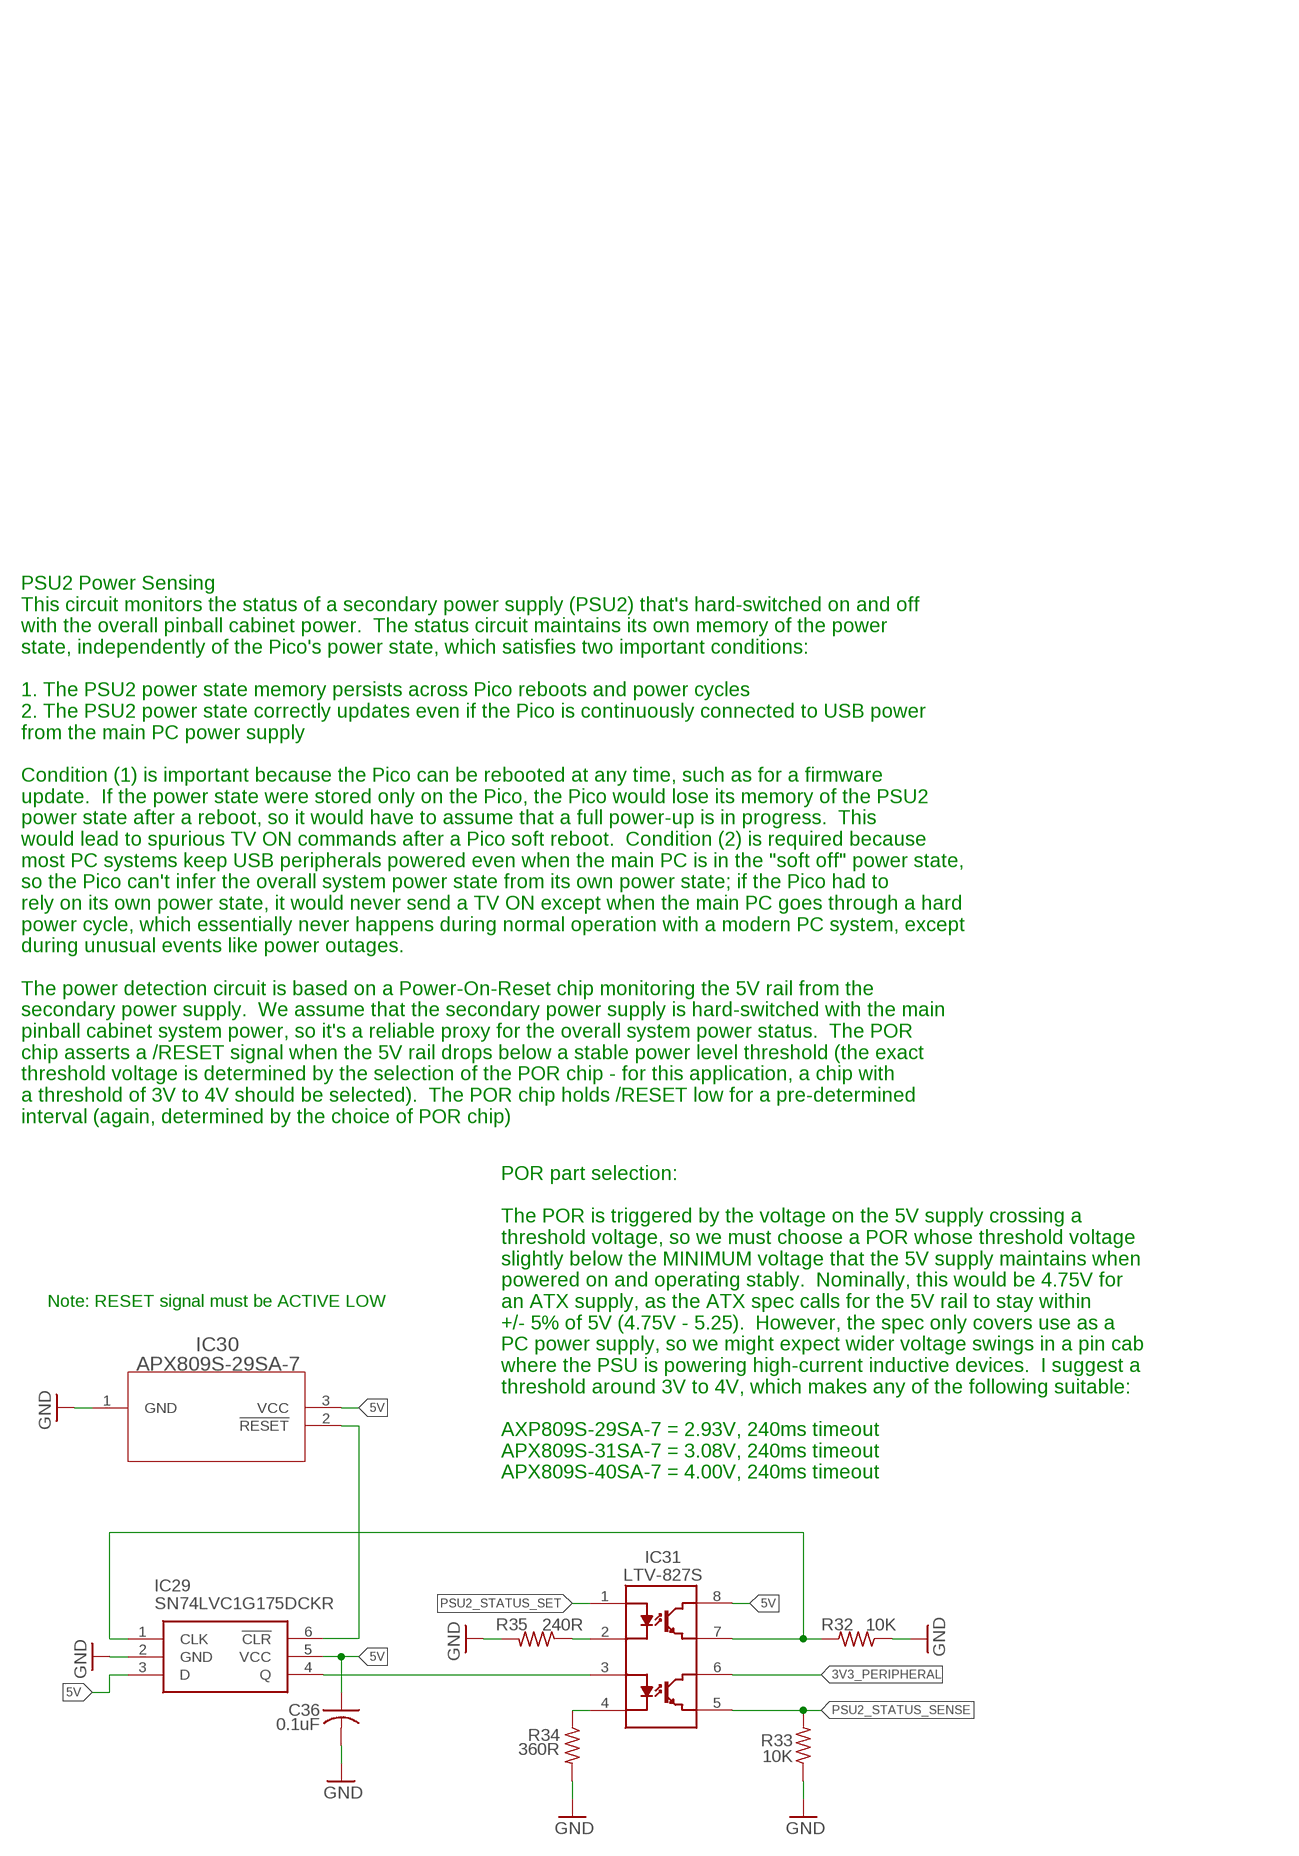
[diagram p8: schematic, sheet 9]

### Parts
C36  0.1uF  C-USC0402  [C0402]
IC29  SN74LVC1G175DCKR  [SOP65P210X110-6N]
IC30  APX809S-29SA-7  APX809S-40SA-7  [SOT23_DIO]
IC31  LTV-827S  [SOP254P1016X460-8N]
R32  10K  R-US_R0402  [R0402]
R33  10K  R-US_R0402  [R0402]
R34  360R  R-US_R0402  [R0402]
R35  240R  R-US_R0402  [R0402]

### Nets
3V3_PERIPHERAL: IC31.6(C_1) ; also sheet 1,2,5,6,7,8,10,11
5V: C36.1 IC29.3(D) IC29.5(VCC) IC30.3(VCC) IC31.8(C_2) ; also sheet 1,6,8,10
GND: C36.2 IC29.2(GND) IC30.1(GND) R32.1 R33.1 R34.2 R35.2 ; also sheet 1,2,3,4,5,6,7,8,10,11
N$58: IC29.1(CLK) IC31.7(E_2) R32.2
N$59: IC31.2(K_1) R35.1
N$63: IC29.6(!CLR) IC30.2(!RESET)
N$65: IC31.4(K_2) R34.1
N$68: IC29.4(Q) IC31.3(A_2)
PSU2_STATUS_SENSE: IC31.5(E_1) R33.2 ; also sheet 1
PSU2_STATUS_SET: IC31.1(A_1) ; also sheet 1

### Notes on the sheet
- PSU2 Power Sensing
  This circuit monitors the status of a secondary power supply (PSU2) that's hard-switched on and off
  with the overall pinball cabinet power.  The status circuit maintains its own memory of the power
  state, independently of the Pico's power state, which satisfies two important conditions:
  
  1. The PSU2 power state memory persists across Pico reboots and power cycles
  2. The PSU2 power state correctly updates even if the Pico is continuously connected to USB power
  from the main PC power supply
  
  Condition (1) is important because the Pico can be rebooted at any time, such as for a firmware
  update.  If the power state were stored only on the Pico, the Pico would lose its memory of the PSU2
  power state after a reboot, so it would have to assume that a full power-up is in progress.  This
  would lead to spurious TV ON commands after a Pico soft reboot.  Condition (2) is required because
  most PC systems keep USB peripherals powered even when the main PC is in the "soft off" power state,
  so the Pico can't infer the overall system power state from its own power state; if the Pico had to
  rely on its own power state, it would never send a TV ON except when the main PC goes through a hard
  power cycle, which essentially never happens during normal operation with a modern PC system, except
  during unusual events like power outages.
  
  The power detection circuit is based on a Power-On-Reset chip monitoring the 5V rail from the
  secondary power supply.  We assume that the secondary power supply is hard-switched with the main
  pinball cabinet system power, so it's a reliable proxy for the overall system power status.  The POR
  chip asserts a /RESET signal when the 5V rail drops below a stable power level threshold (the exact
  threshold voltage is determined by the selection of the POR chip - for this application, a chip with
  a threshold of 3V to 4V should be selected).  The POR chip holds /RESET low for a pre-determined
  interval (again, determined by the choice of POR chip) after the rail rises above the threshold
  voltage, and then takes /RESET high to indicate that power is stable.  The detector circuit uses
  /RESET as a signal to clear the flip-flop to logic '0' state - this is where the memory of the power
  state is stored.  The flip-flop's output (Q) is connected to a Pico GPIO, PSU2_STATUS_SENSE,
  through an optocoupler; this serves to isolate the flip-flop's 5V system from the Pico's 3.3V system.
  When the 5V power is off, the Q output will read as low simply by virtue of not being powered, so
  the opto will be off, and PSU2_STATUS_SENSE will be pulled to GND and thus will read as logic '0'.
  When the 5V power initially comes on, the POR /RESET signal will ensure that Q is still held at
  logic '0', so the Pico will continue to see logic '0' on the opto output.  So the Pico will see a
  logic '0' continuously as long as 5V power is out, AND after 5V power returns, until the flip-flop
  state is explicitly updated.  The Pico has a second GPIO, PSU2_STATUS_SET, that sends a signal to
  the flip-flop.  This signal is also mediated through an optocoupler interface between the 3.3V and
  5V power systems, translating the 3.3V signal to 5V in positive logic.  This signal leads to the
  flip-flop clock input.  When the Pico toggles the flip-flop clock high, the flip-flop loads the D
  input, which is hard-wired to a high level logic '1', to its Q output.  This is the action that
  SETS the power state memory.
  
  The software uses this by polling PSU2_STATUS_SENSE.  If this reads as logic '1', it means that 5V
  power (and thus overall pin cab system power) has been ON continuously since the last poll, so no
  power-cycle action is required.  If it reads as '0', it means that 5V power is either OFF right now,
  OR that a main system power cycle has occurred since the last update, and power is back on now.  The
  software can distinguish these two cases by toggling PSU_STATUS_SET to '1' briefly and then back to
  '0', and then reading PSU2_STATUS_SENSE again.  If 5V power is OFF, the flip-flop isn't powered, so
  the SET operation will have no effect, and PSU2_STATUS_SENSE will still read as '0'.  If 5V power
  is ON, the flip-flop will carry out the SET operation, and PSU2_STATUS_SENSE will now read as '1'.
  When this transition occurs, the software knows that a power cycle has occurred since the last
  update, so it should carry out the power-on actions (e.g., sending the TV ON signals).
- Note: RESET signal must be ACTIVE LOW
- POR part selection:
  
  The POR is triggered by the voltage on the 5V supply crossing a
  threshold voltage, so we must choose a POR whose threshold voltage
  slightly below the MINIMUM voltage that the 5V supply maintains when
  powered on and operating stably.  Nominally, this would be 4.75V for
  an ATX supply, as the ATX spec calls for the 5V rail to stay within
  +/- 5% of 5V (4.75V - 5.25).  However, the spec only covers use as a
  PC power supply, so we might expect wider voltage swings in a pin cab
  where the PSU is powering high-current inductive devices.  I suggest a
  threshold around 3V to 4V, which makes any of the following suitable:
  
  AXP809S-29SA-7 = 2.93V, 240ms timeout
  APX809S-31SA-7 = 3.08V, 240ms timeout
  APX809S-40SA-7 = 4.00V, 240ms timeout

## Sheet 10 of 12: IR Remote
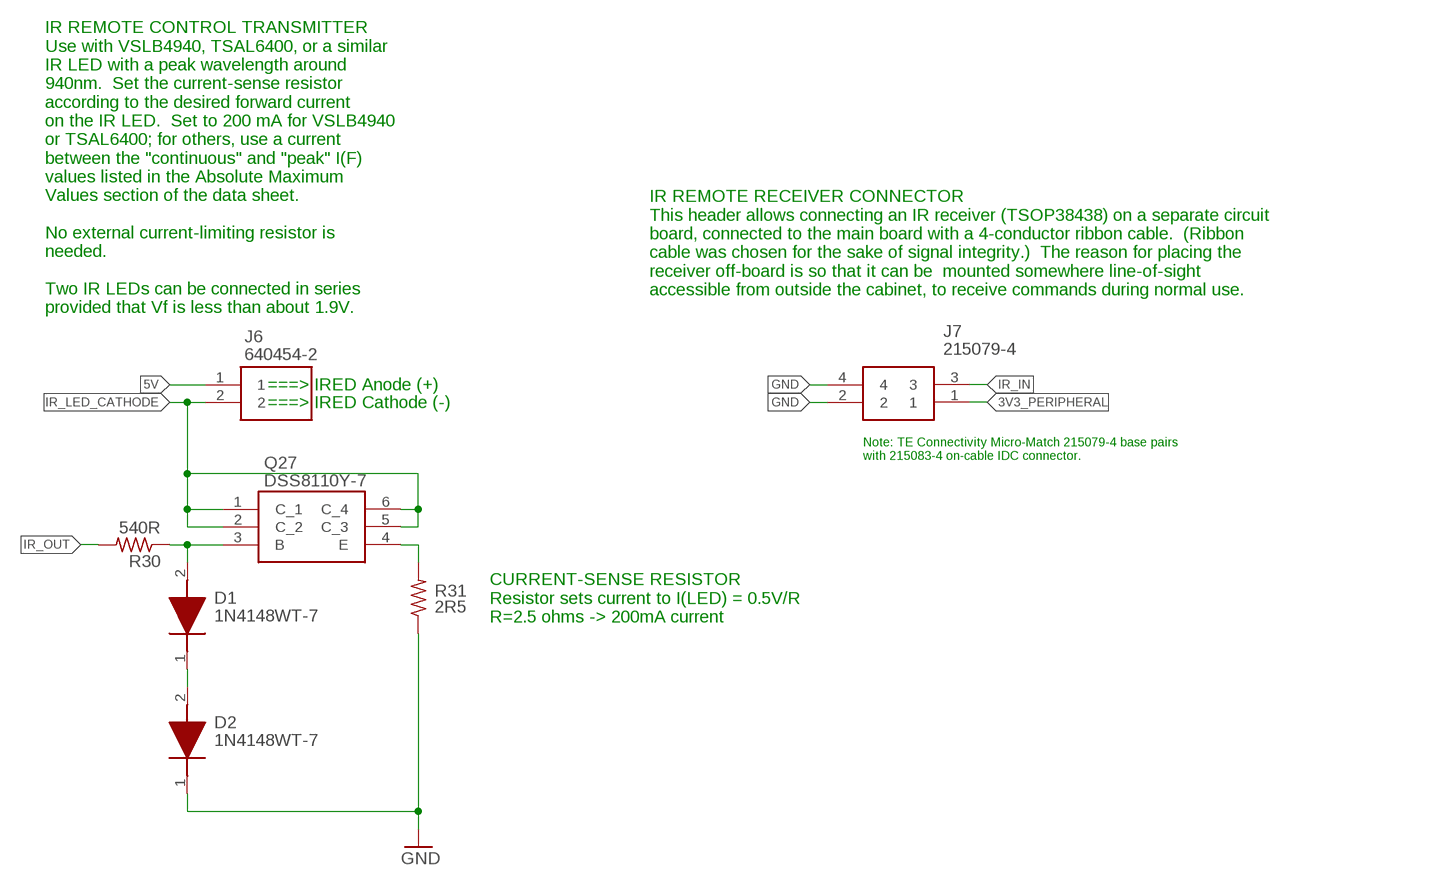
[diagram p9: schematic, sheet 10]

### Parts
D1  1N4148WT-7  [1N4148WT7]
D2  1N4148WT-7  [1N4148WT7]
J6  640454-2  [HDRV2W66P0X254_1X2_762X572X100]
J7  215079-4  [2150794]
Q27  DSS8110Y-7  [SOT65P210X110-6N]
R30  540R  R-US_R0402  [R0402]
R31  2R5  R-US_R0603  [R0603]

### Nets
3V3_PERIPHERAL: J7.1 ; also sheet 1,2,5,6,7,8,9,11
5V: J6.1 ; also sheet 1,6,8,9
GND: D2.1(K) J7.2 J7.4 R31.1 ; also sheet 1,2,3,4,5,6,7,8,9,11
IR_IN: J7.3 ; also sheet 1
IR_LED_CATHODE: J6.2 Q27.1(C_1) Q27.2(C_2) Q27.5(C_3) Q27.6(C_4)
IR_OUT: R30.2 ; also sheet 1
N$32: Q27.4(E) R31.2
N$77: D1.2(A) Q27.3(B) R30.1
N$81: D1.1(K) D2.2(A)

### Notes on the sheet
- IR REMOTE RECEIVER CONNECTOR
  This header allows connecting an IR receiver (TSOP38438) on a separate circuit
  board, connected to the main board with a 4-conductor ribbon cable.  (Ribbon
  cable was chosen for the sake of signal integrity.)  The reason for placing the
  receiver off-board is so that it can be  mounted somewhere line-of-sight
  accessible from outside the cabinet, to receive commands during normal use.
- IR REMOTE CONTROL TRANSMITTER
  Use with VSLB4940, TSAL6400, or a similar
  IR LED with a peak wavelength around
  940nm.  Set the current-sense resistor
  according to the desired forward current
  on the IR LED.  Set to 200 mA for VSLB4940
  or TSAL6400; for others, use a current
  between the "continuous" and "peak" I(F)
  values listed in the Absolute Maximum
  Values section of the data sheet.
  
  No external current-limiting resistor is
  needed.
  
  Two IR LEDs can be connected in series
  provided that Vf is less than about 1.9V.
- ===> IRED Anode (+)
- ===> IRED Cathode (-)
- Note: TE Connectivity Micro-Match 215079-4 base pairs
  with 215083-4 on-cable IDC connector.
- CURRENT-SENSE RESISTOR
  Resistor sets current to I(LED) = 0.5V/R
  R=2.5 ohms -> 200mA current

## Sheet 11 of 12: RTC (Real-time clock)
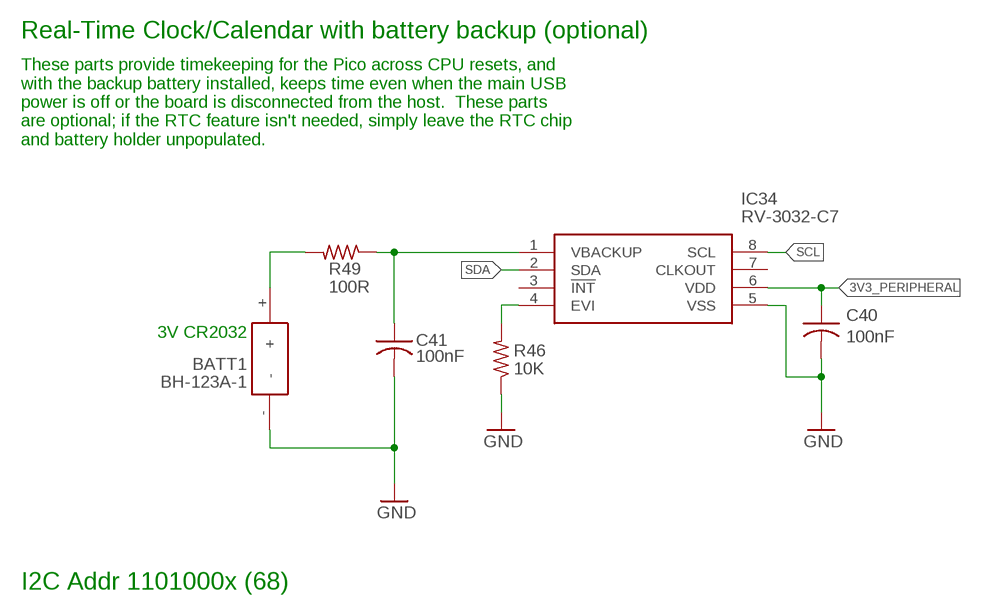
[diagram p10: schematic, sheet 11]

### Parts
BATT1  BH-123A-1  [BH-123A-1]
C40  100nF  C-USC0402  [C0402]
C41  100nF  C-USC0402  [C0402]
IC34  RV-3032-C7  RV-3032-C7_32.768KHZ-2.5PPM-TA  [RV3032C7]
R46  10K  R-US_R0402  [R0402]
R49  100R  R-US_R0402  [R0402]

### Nets
3V3_PERIPHERAL: C40.1 IC34.6(VDD) ; also sheet 1,2,5,6,7,8,9,10
GND: BATT1.- C40.2 C41.2 IC34.5(VSS) R46.1 ; also sheet 1,2,3,4,5,6,7,8,9,10
N$72: BATT1.+ R49.2
N$73: IC34.4(EVI) R46.2
N$76: C41.1 IC34.1(VBACKUP) R49.1
SCL: IC34.8(SCL) ; also sheet 1,2,5,6,7,8
SDA: IC34.2(SDA) ; also sheet 1,2,5,6,7,8
Unconnected: IC34.3(!INT) IC34.7(CLKOUT)

### Notes on the sheet
- Real-Time Clock/Calendar with battery backup (optional)
- These parts provide timekeeping for the Pico across CPU resets, and 
  with the backup battery installed, keeps time even when the main USB
  power is off or the board is disconnected from the host.  These parts
  are optional; if the RTC feature isn't needed, simply leave the RTC chip
  and battery holder unpopulated.
- 3V CR2032
- I2C Addr 1101000x (68)

## Sheet 12 of 12: Notes
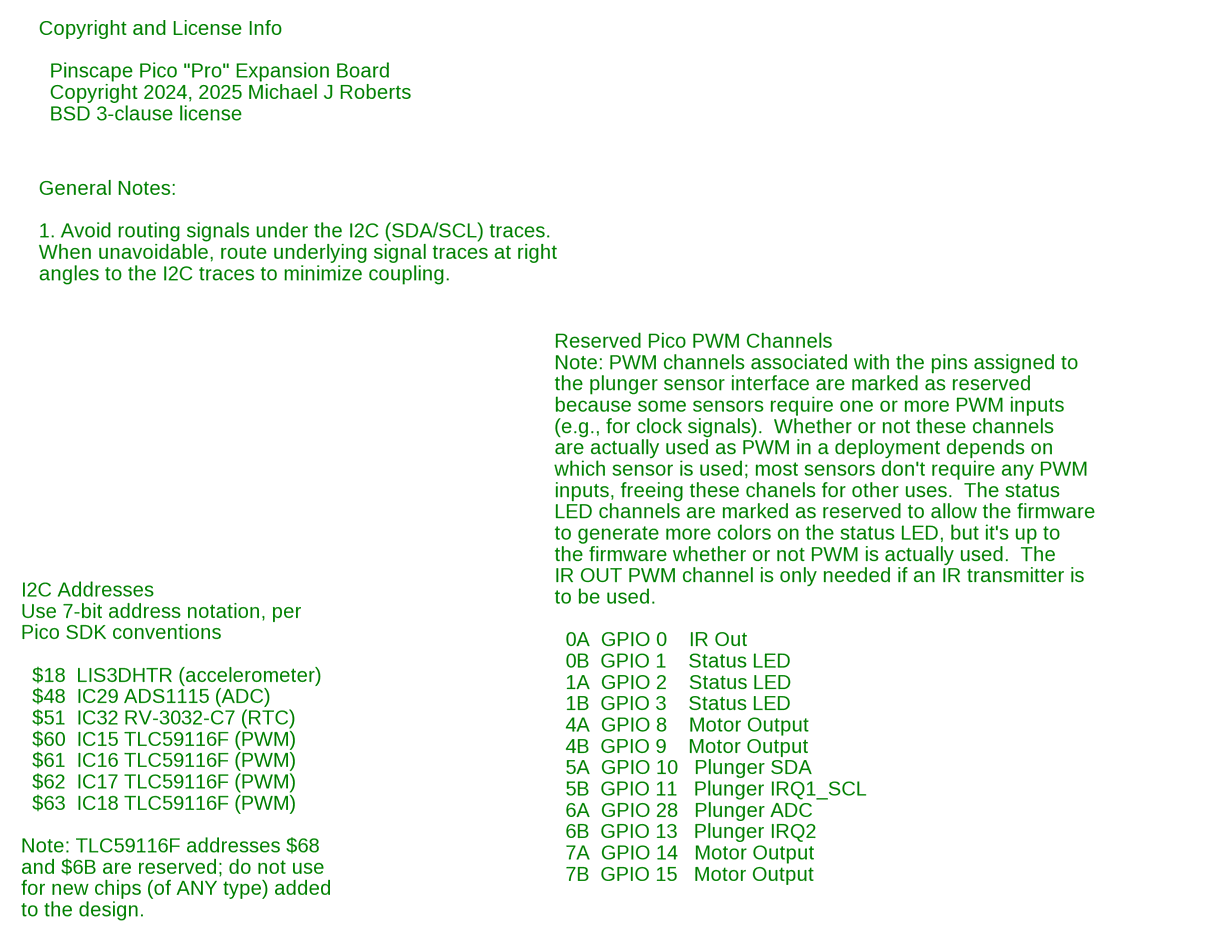
[diagram p11: schematic, sheet 12]

### Notes on the sheet
- Copyright and License Info
  
    Pinscape Pico "Pro" Expansion Board
    Copyright 2024, 2025 Michael J Roberts
    BSD 3-clause license
- General Notes:
  
  1. Avoid routing signals under the I2C (SDA/SCL) traces.  
  When unavoidable, route underlying signal traces at right
  angles to the I2C traces to minimize coupling.
- Reserved Pico PWM Channels
  Note: PWM channels associated with the pins assigned to
  the plunger sensor interface are marked as reserved
  because some sensors require one or more PWM inputs
  (e.g., for clock signals).  Whether or not these channels
  are actually used as PWM in a deployment depends on
  which sensor is used; most sensors don't require any PWM
  inputs, freeing these chanels for other uses.  The status
  LED channels are marked as reserved to allow the firmware
  to generate more colors on the status LED, but it's up to
  the firmware whether or not PWM is actually used.  The
  IR OUT PWM channel is only needed if an IR transmitter is
  to be used.
  
    0A  GPIO 0    IR Out
    0B  GPIO 1    Status LED
    1A  GPIO 2    Status LED
    1B  GPIO 3    Status LED
    4A  GPIO 8    Motor Output
    4B  GPIO 9    Motor Output
    5A  GPIO 10   Plunger SDA
    5B  GPIO 11   Plunger IRQ1_SCL
    6A  GPIO 28   Plunger ADC
    6B  GPIO 13   Plunger IRQ2
    7A  GPIO 14   Motor Output
    7B  GPIO 15   Motor Output
- I2C Addresses
  Use 7-bit address notation, per
  Pico SDK conventions
  
    $18  LIS3DHTR (accelerometer)
    $48  IC29 ADS1115 (ADC)
    $51  IC32 RV-3032-C7 (RTC)
    $60  IC15 TLC59116F (PWM)
    $61  IC16 TLC59116F (PWM)
    $62  IC17 TLC59116F (PWM)
    $63  IC18 TLC59116F (PWM)
  
  Note: TLC59116F addresses $68
  and $6B are reserved; do not use
  for new chips (of ANY type) added
  to the design.